# EasyEDA Pro project RK3568_DEV.epro, schematic Schematic1, sheets 1 to 12 of 27

## Sheets
1 SOC_CAM: Board Name: Board1; Create Date: 2025-08-15; Page Name: SOC_CAM; Project Name: RK3568_LPD4X_120P_Core; Schematic Name: Schematic1; Update Date: 2025-08-22; BladeWidth: 10; Company: 嘉立创EDA; Page Size: A4; RegionStart: 1; ShowBorder: 1; TitleBlock: 1; TitleBlockPosition: 3; Version: V1.0; XRegionCount: 6; YRegionCount: 4
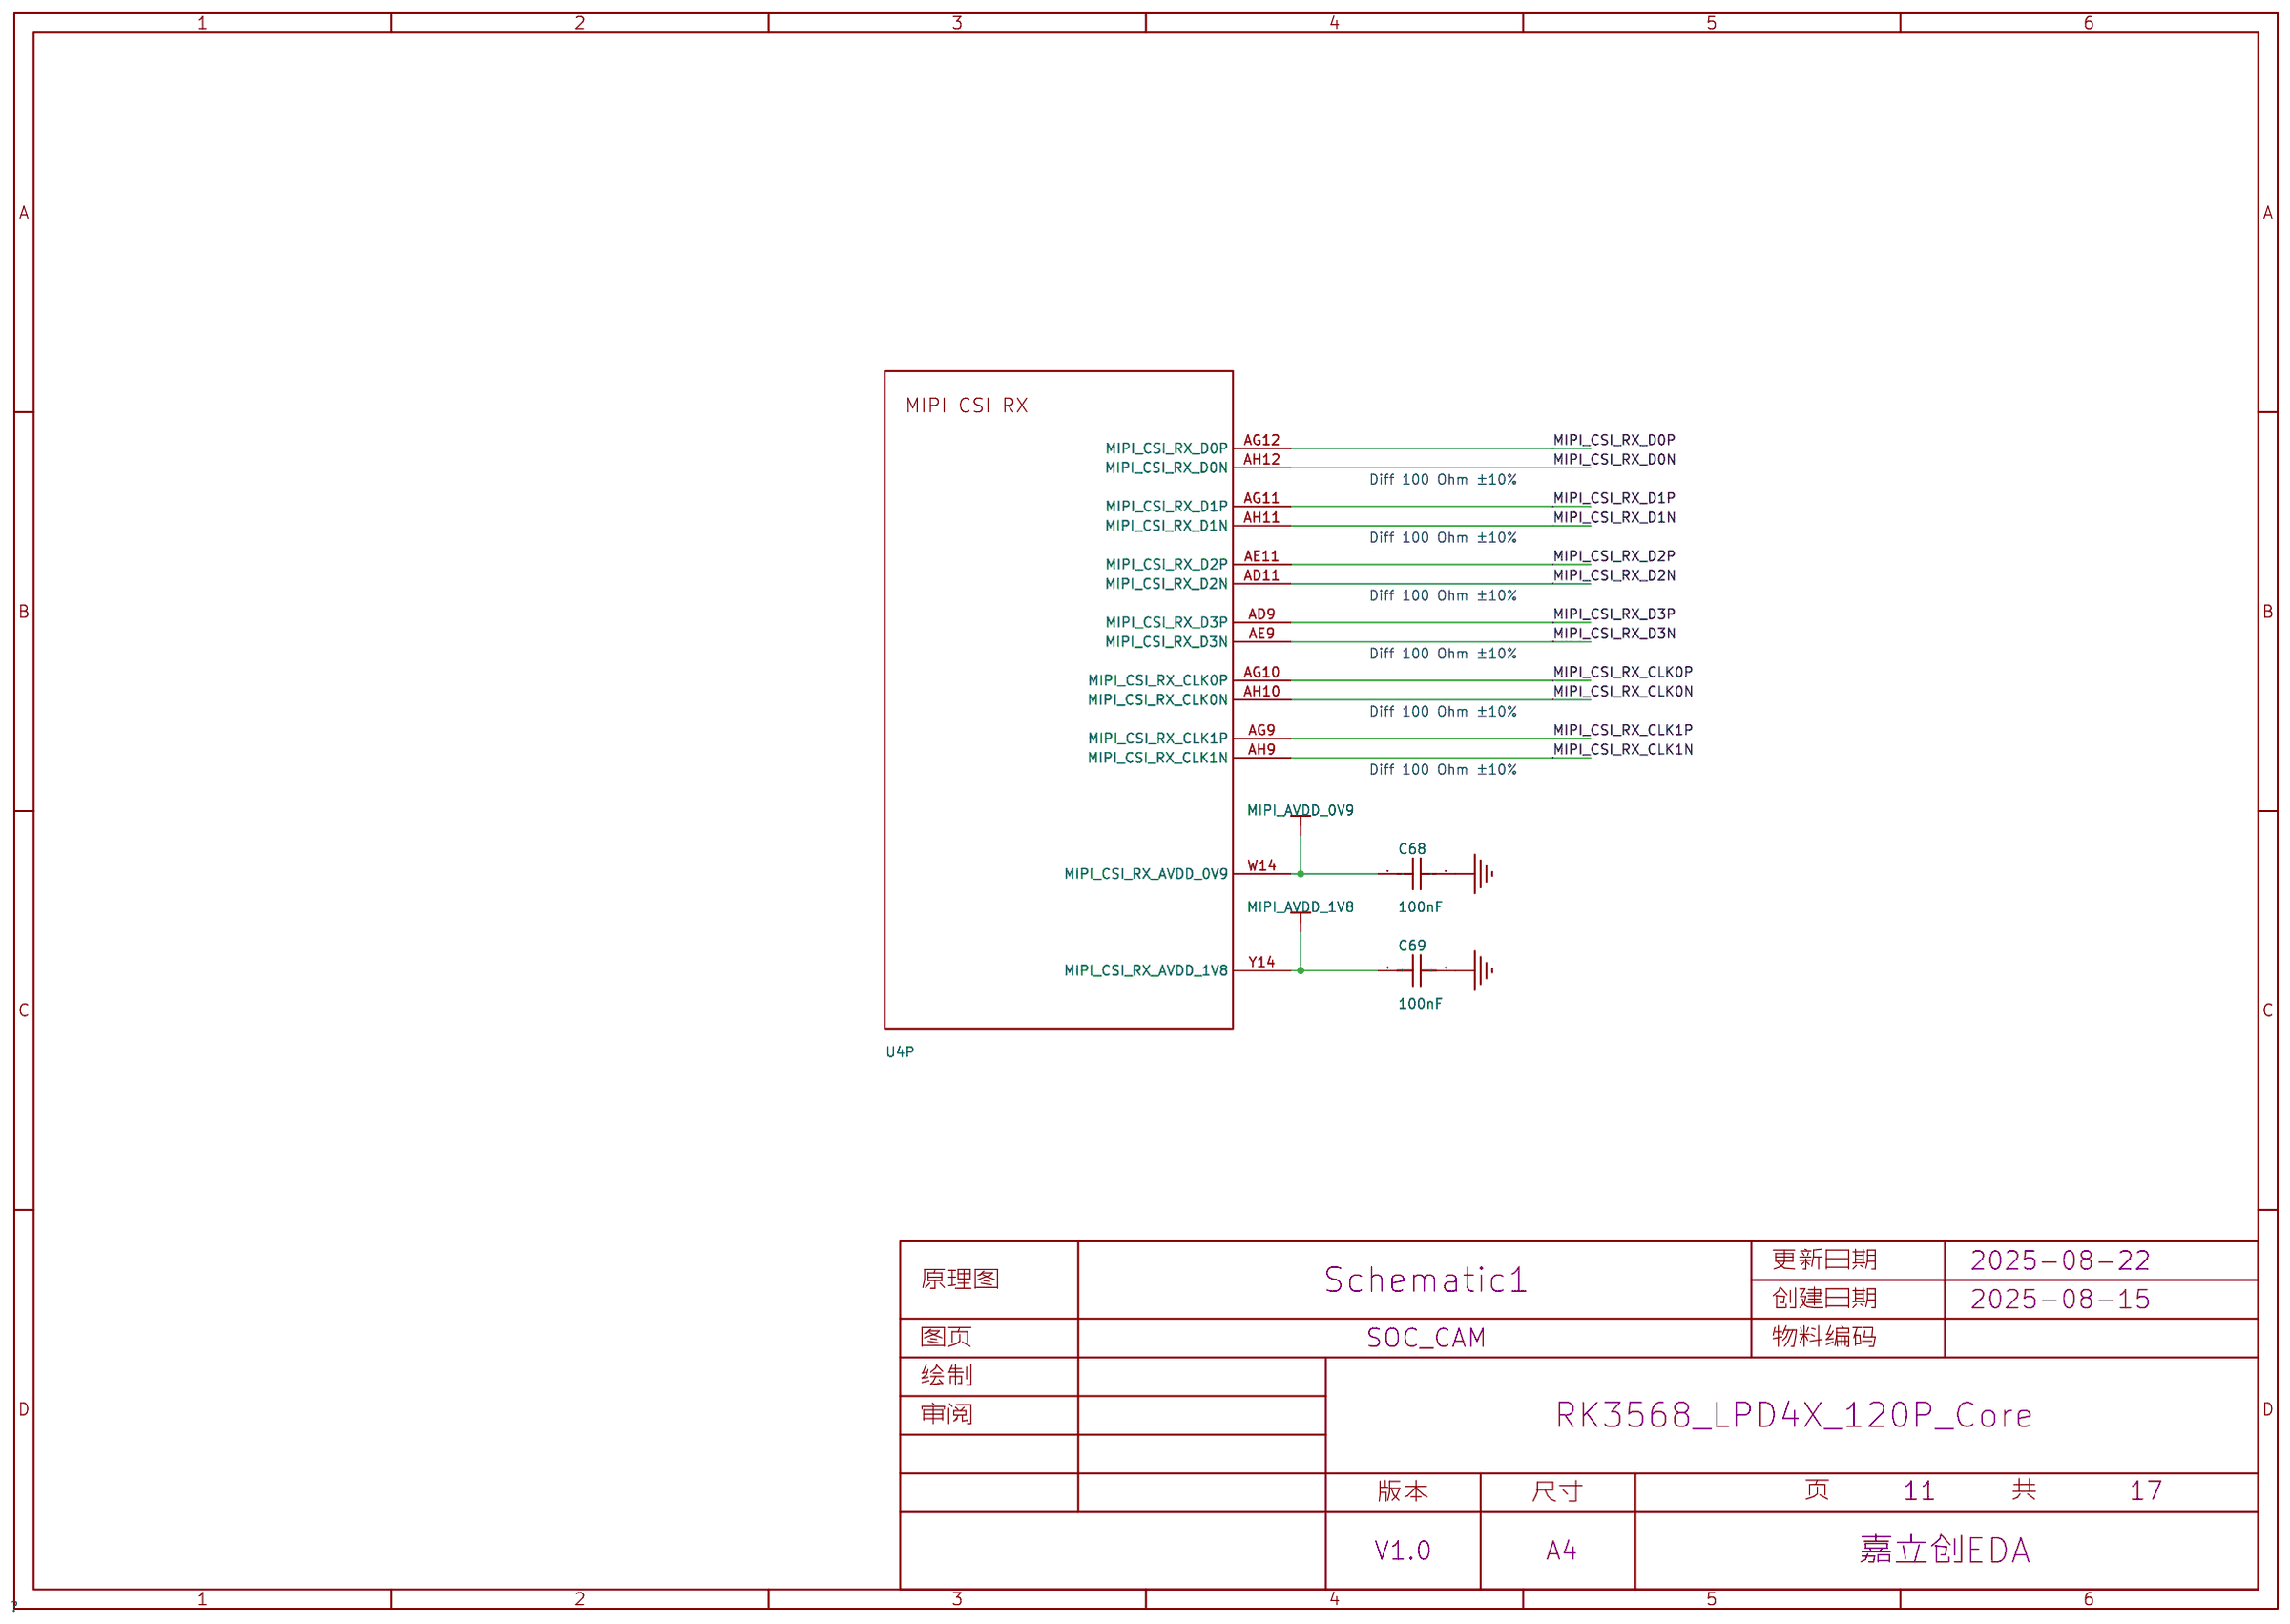
[diagram p0: SOC_CAM]
2 项目概述: Create Date: 2025-09-28; Page Name: 项目概述; Project Name: Rk3568B路由器; Update Date: 2025-09-28
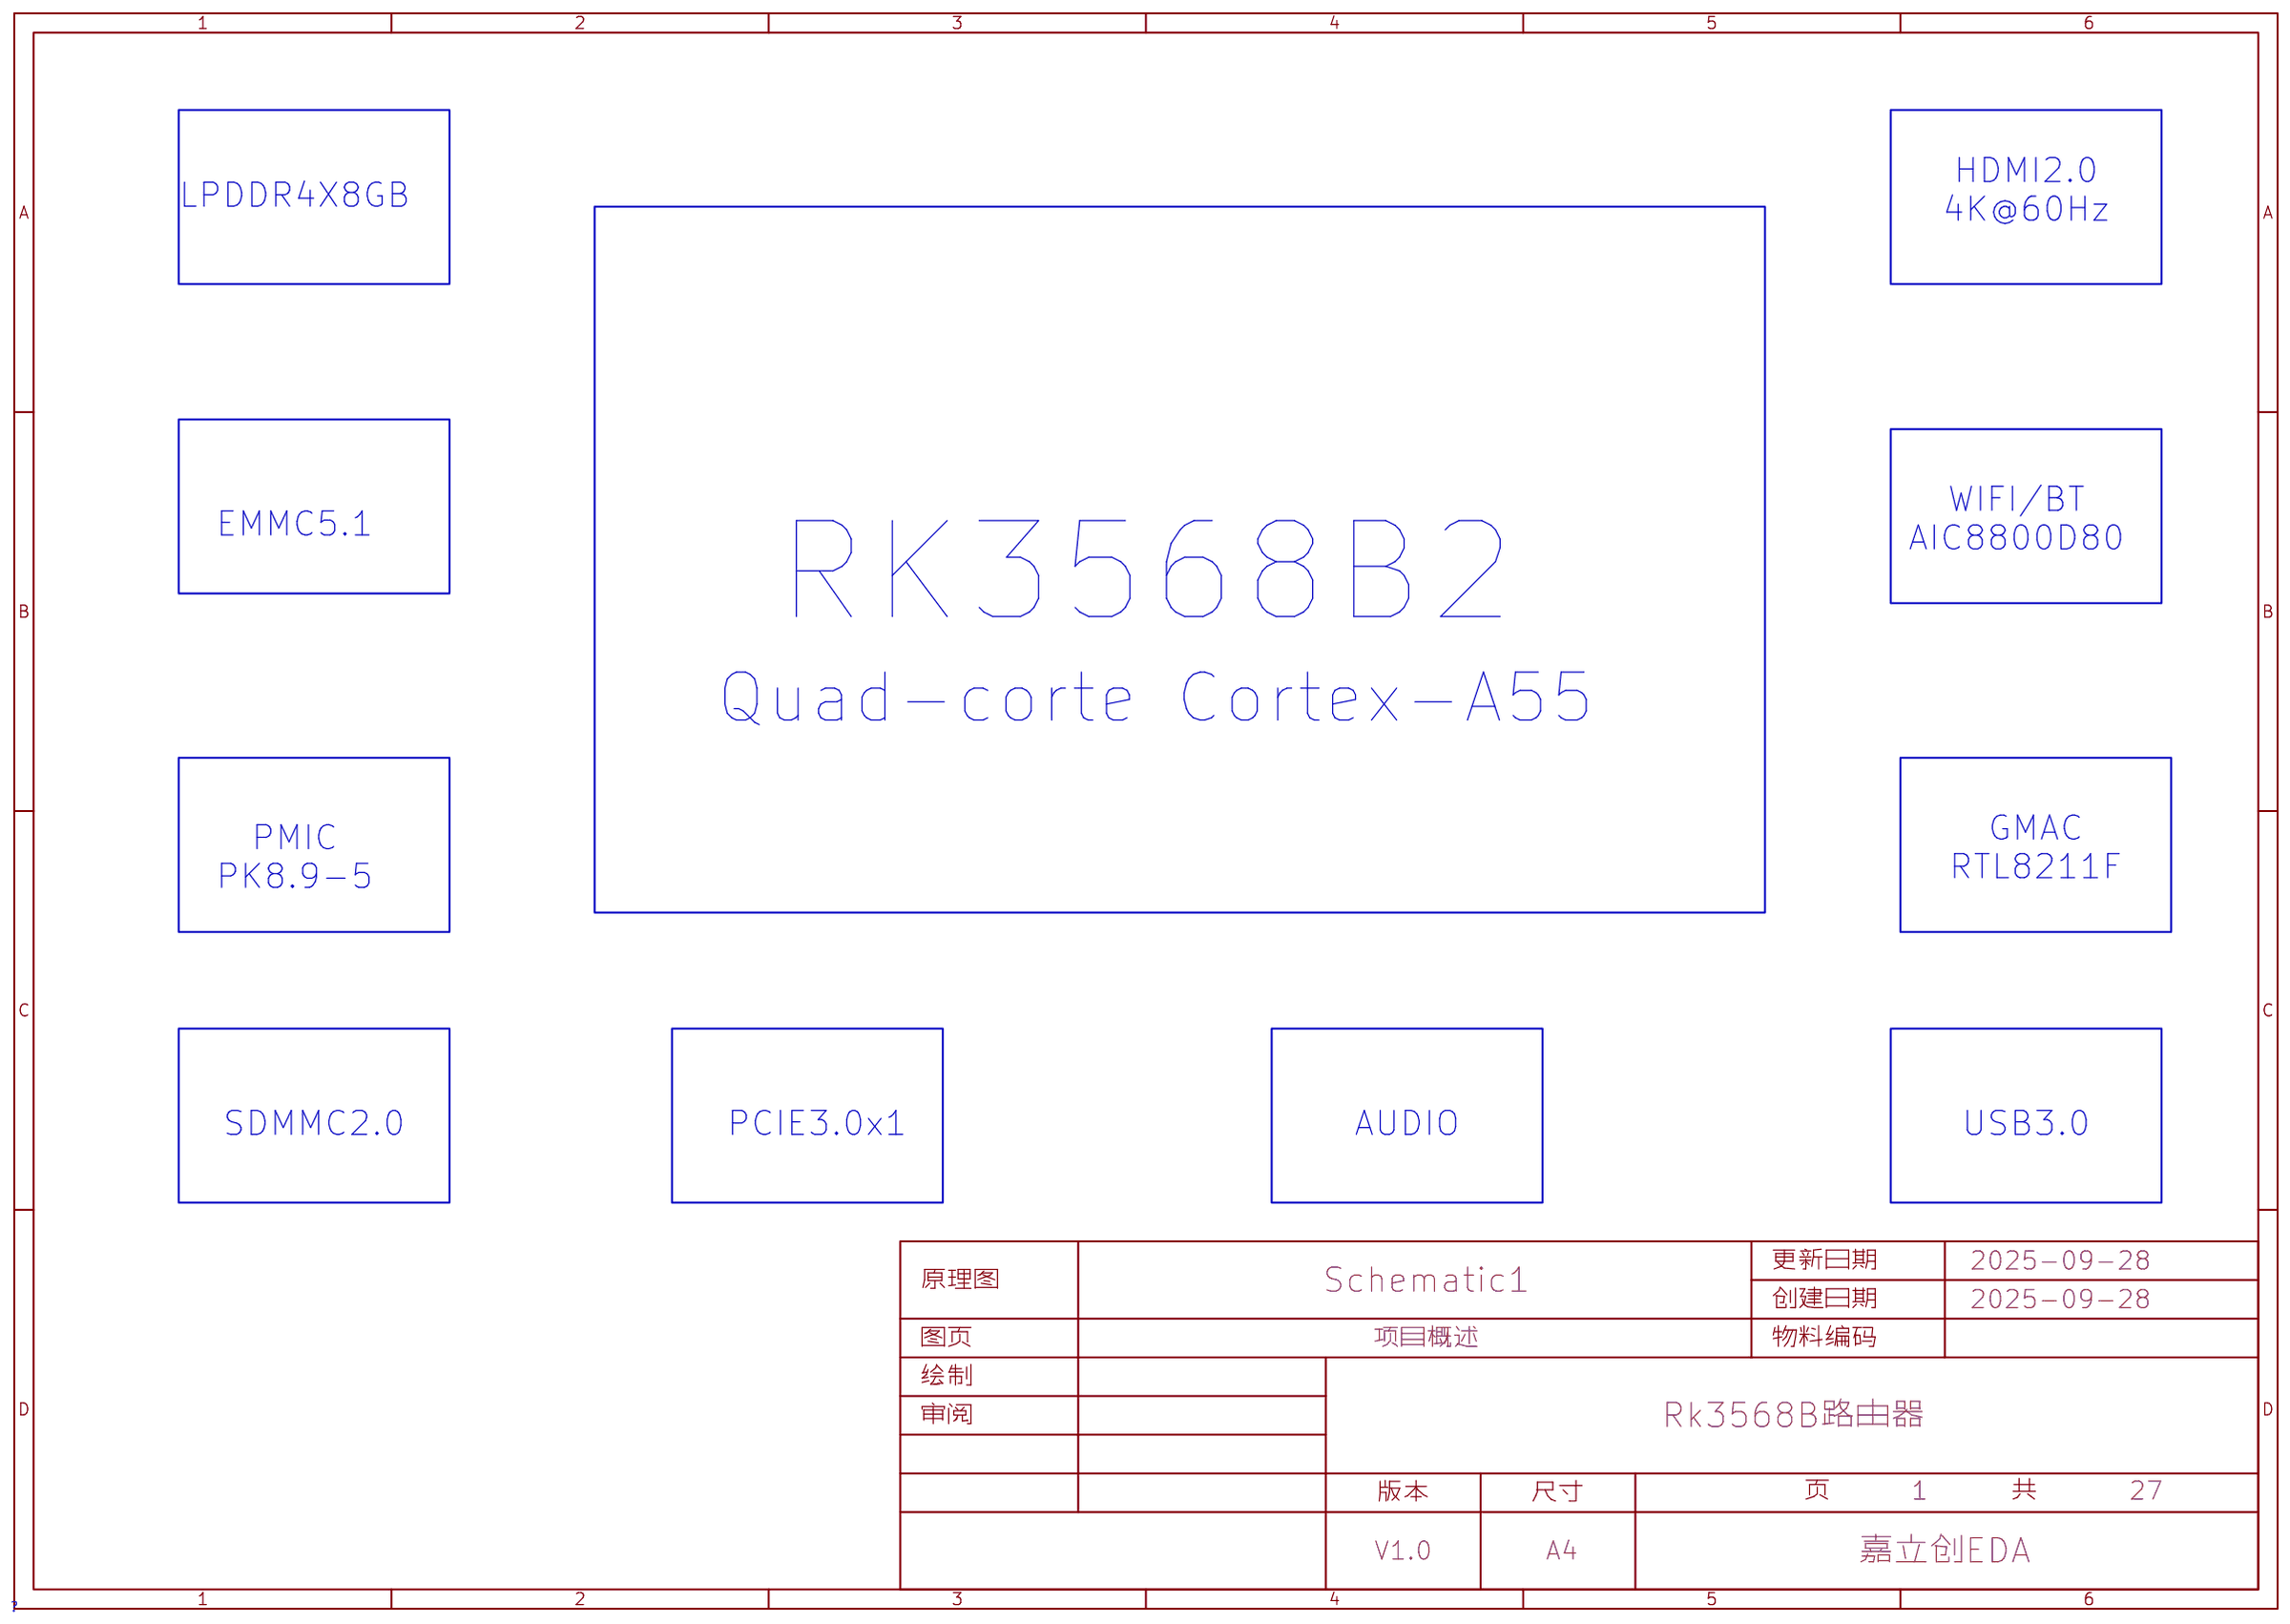
[diagram p1: 项目概述]
3 外设资源分配&上电时序: Page Name: 外设资源分配&上电时序; Project Name: ProDoc_Board1_2026-04-14; Update Date: 2026-04-03
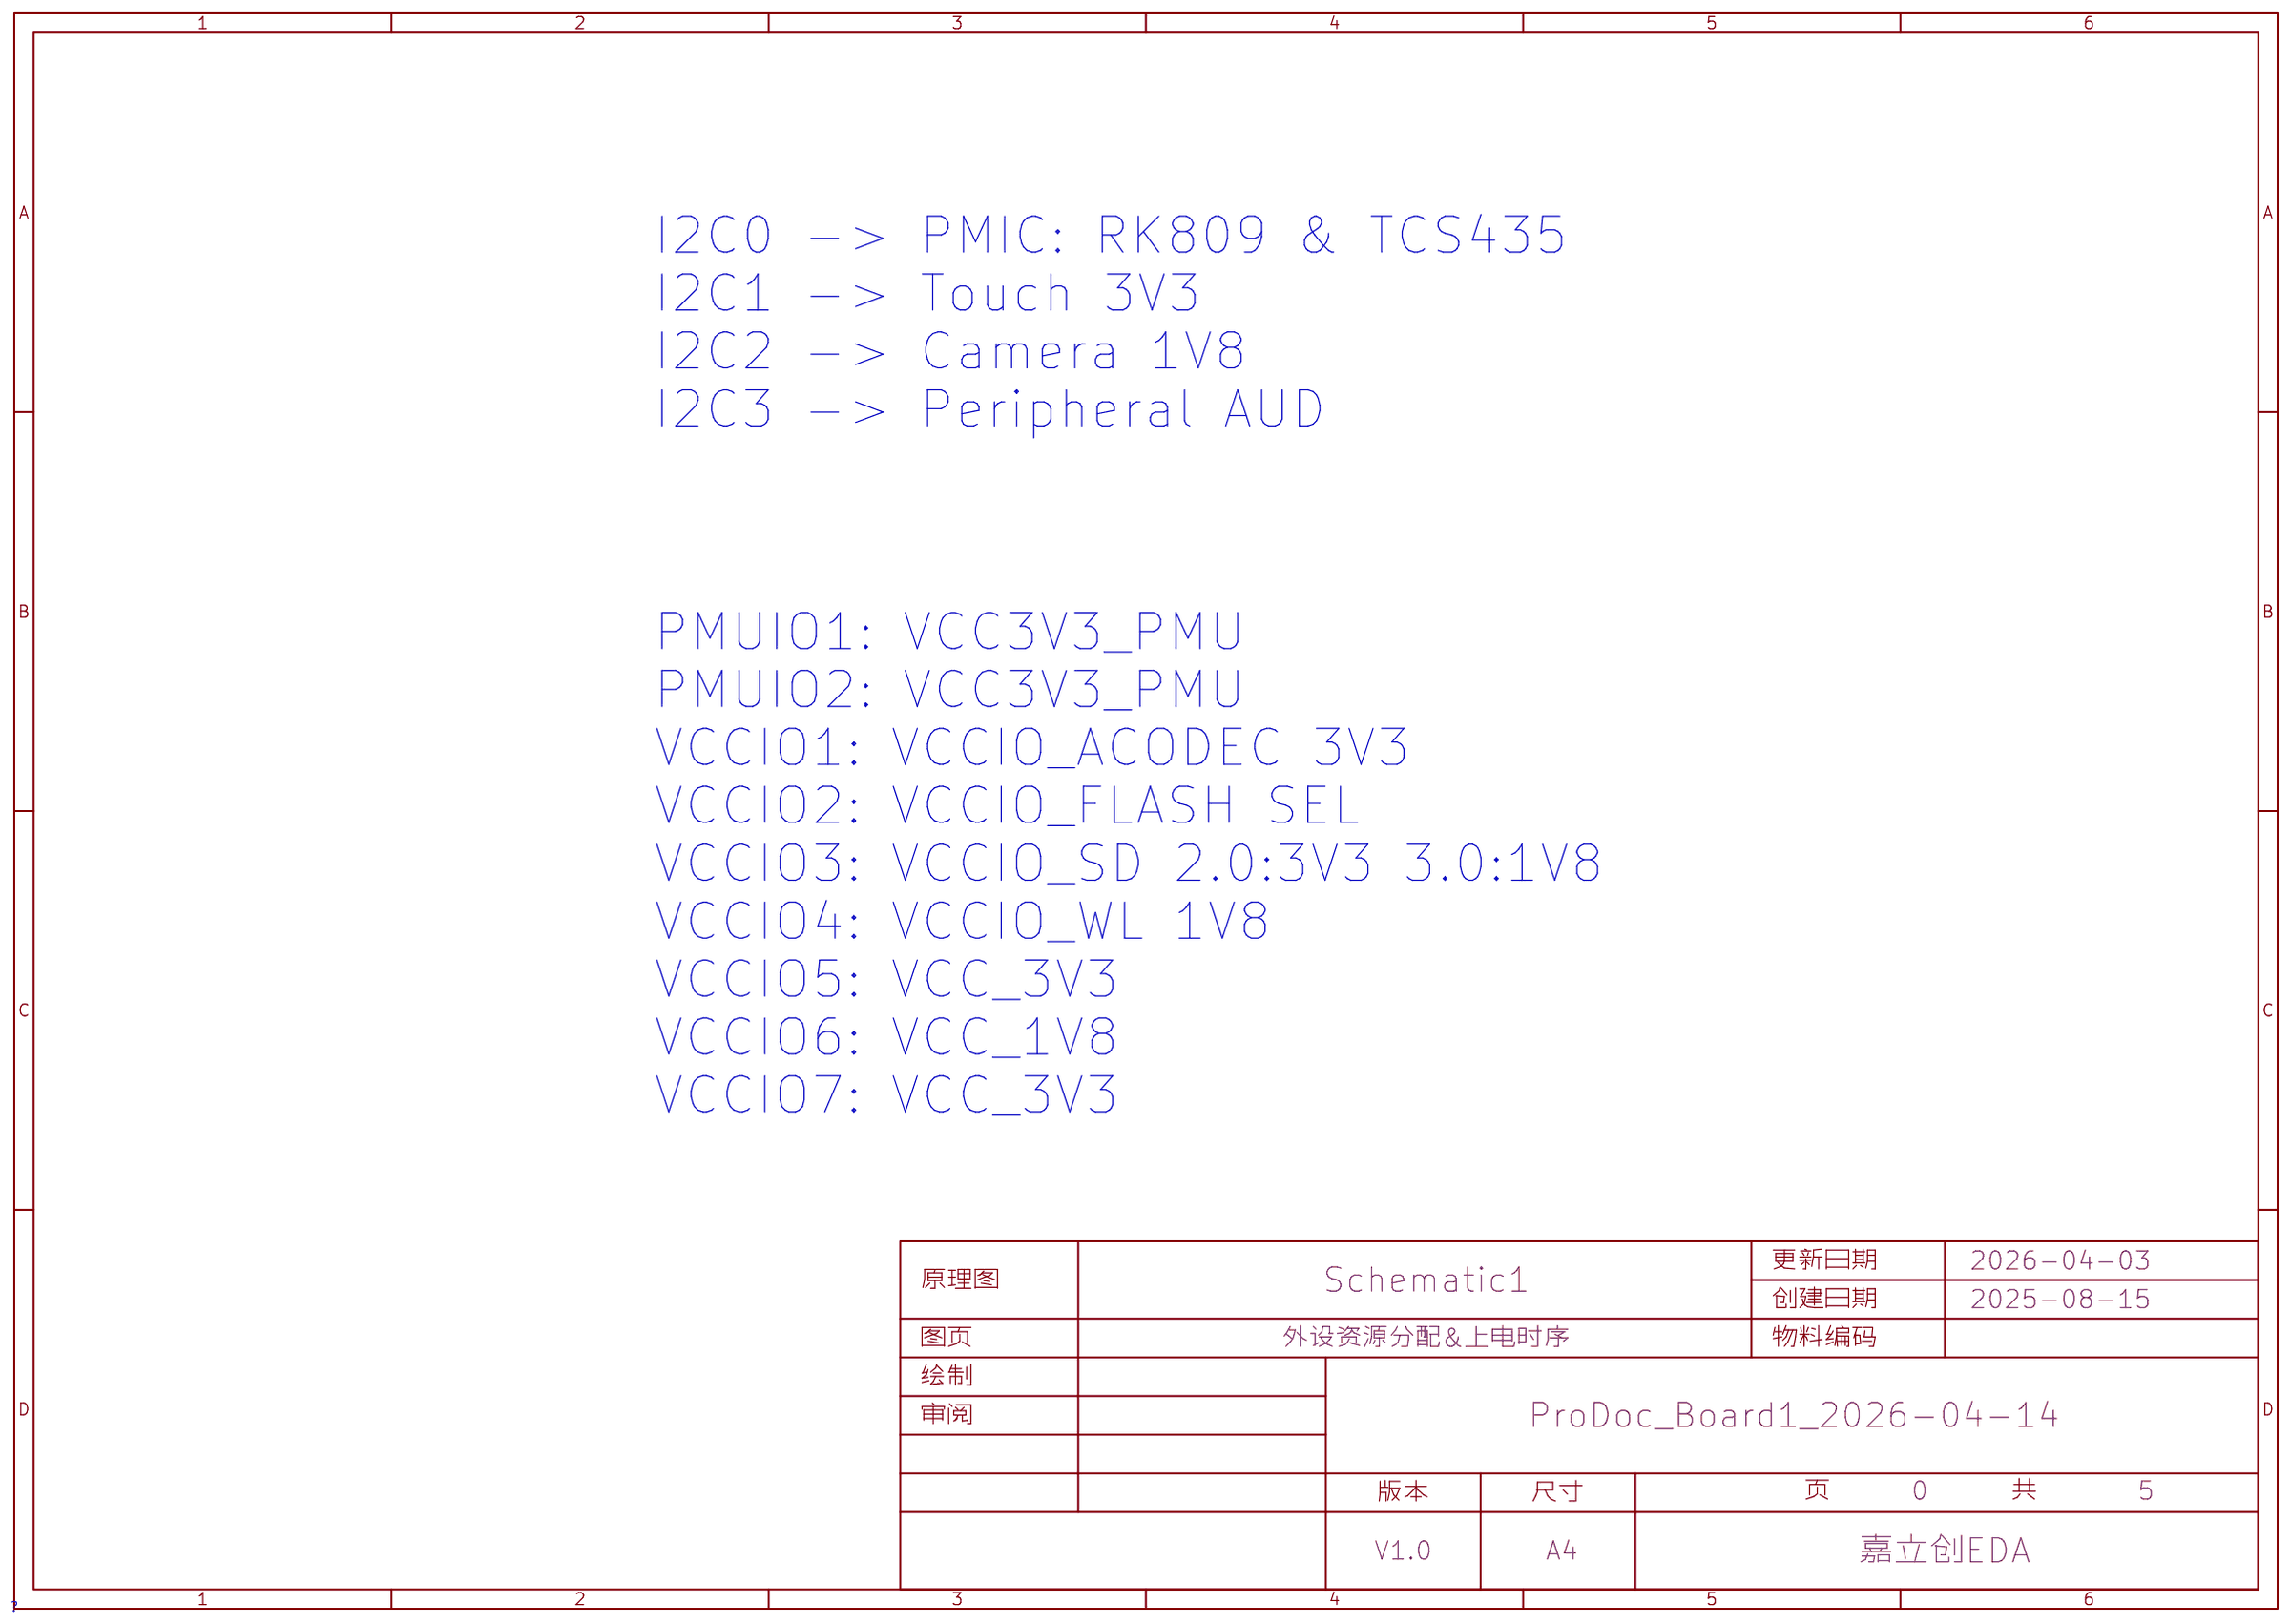
[diagram p2: 外设资源分配&上电时序]
4 KEY/LED: Create Date: 2025-09-11; Page Name: KEY/LED; Project Name: RK3568B2地瓜派; Update Date: 2025-09-11
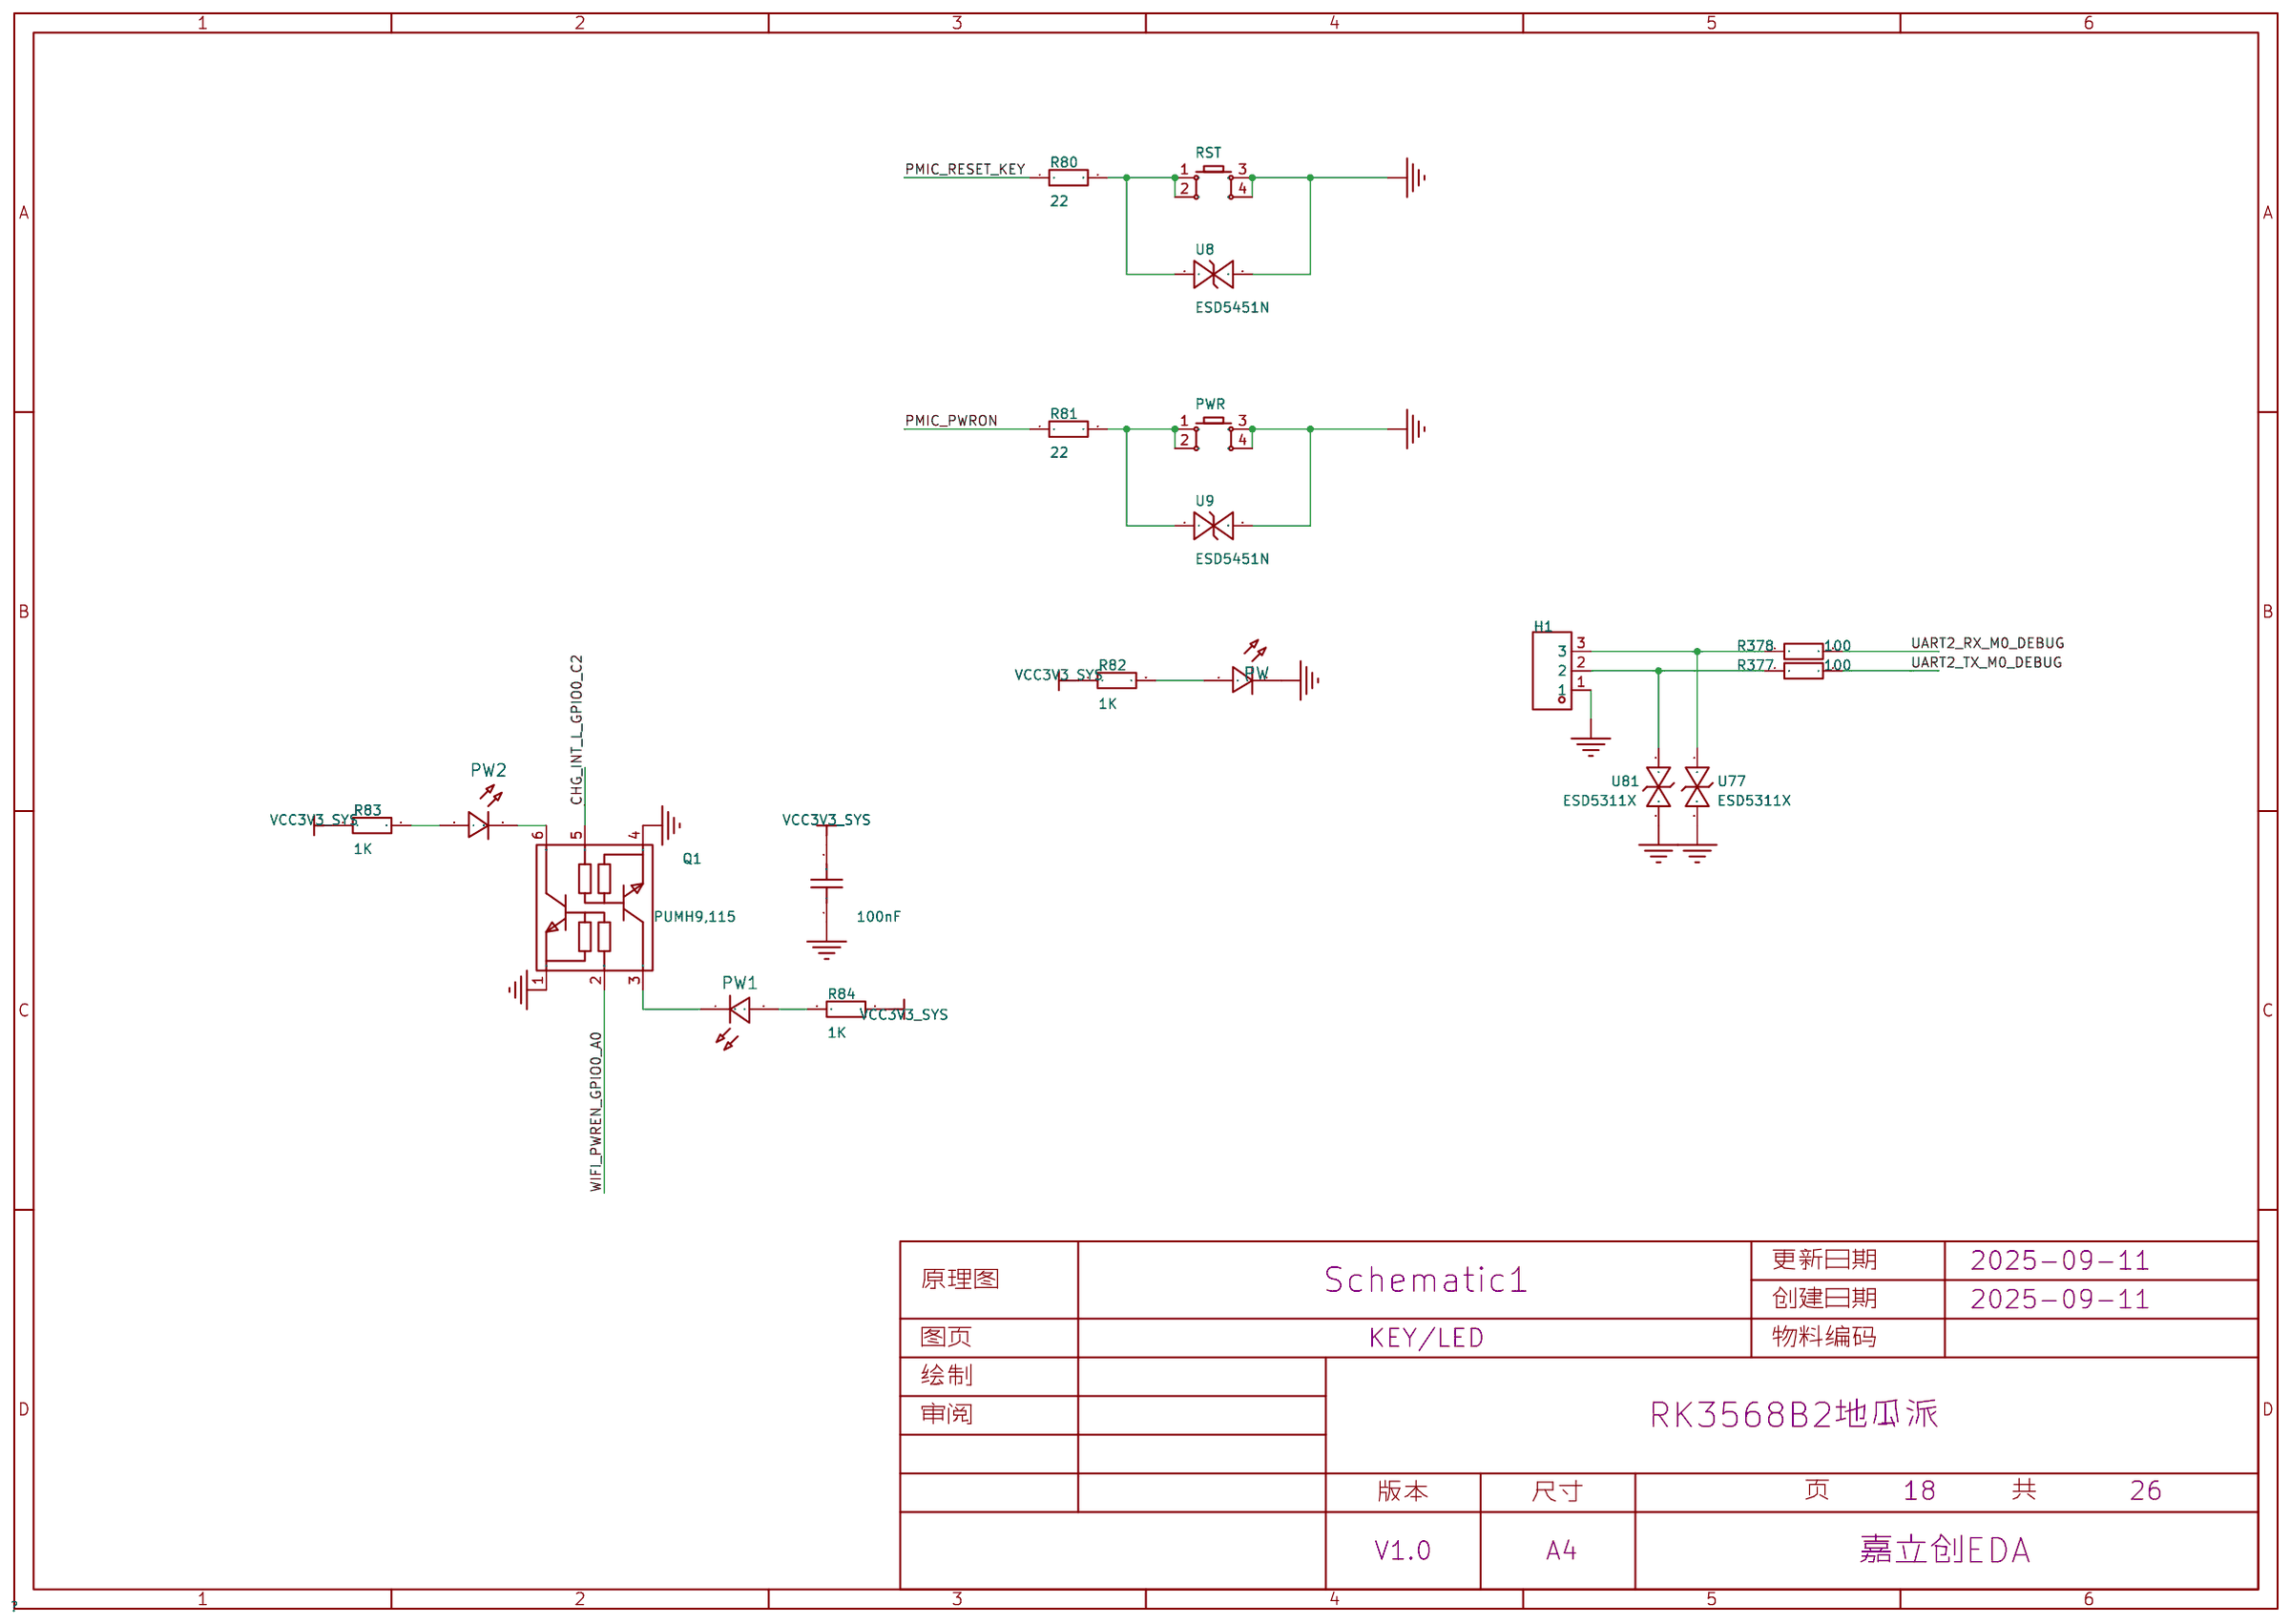
[diagram p3: KEY/LED]
5 SOC_LOGIC: Page Name: SOC_LOGIC; Update Date: 2025-08-26
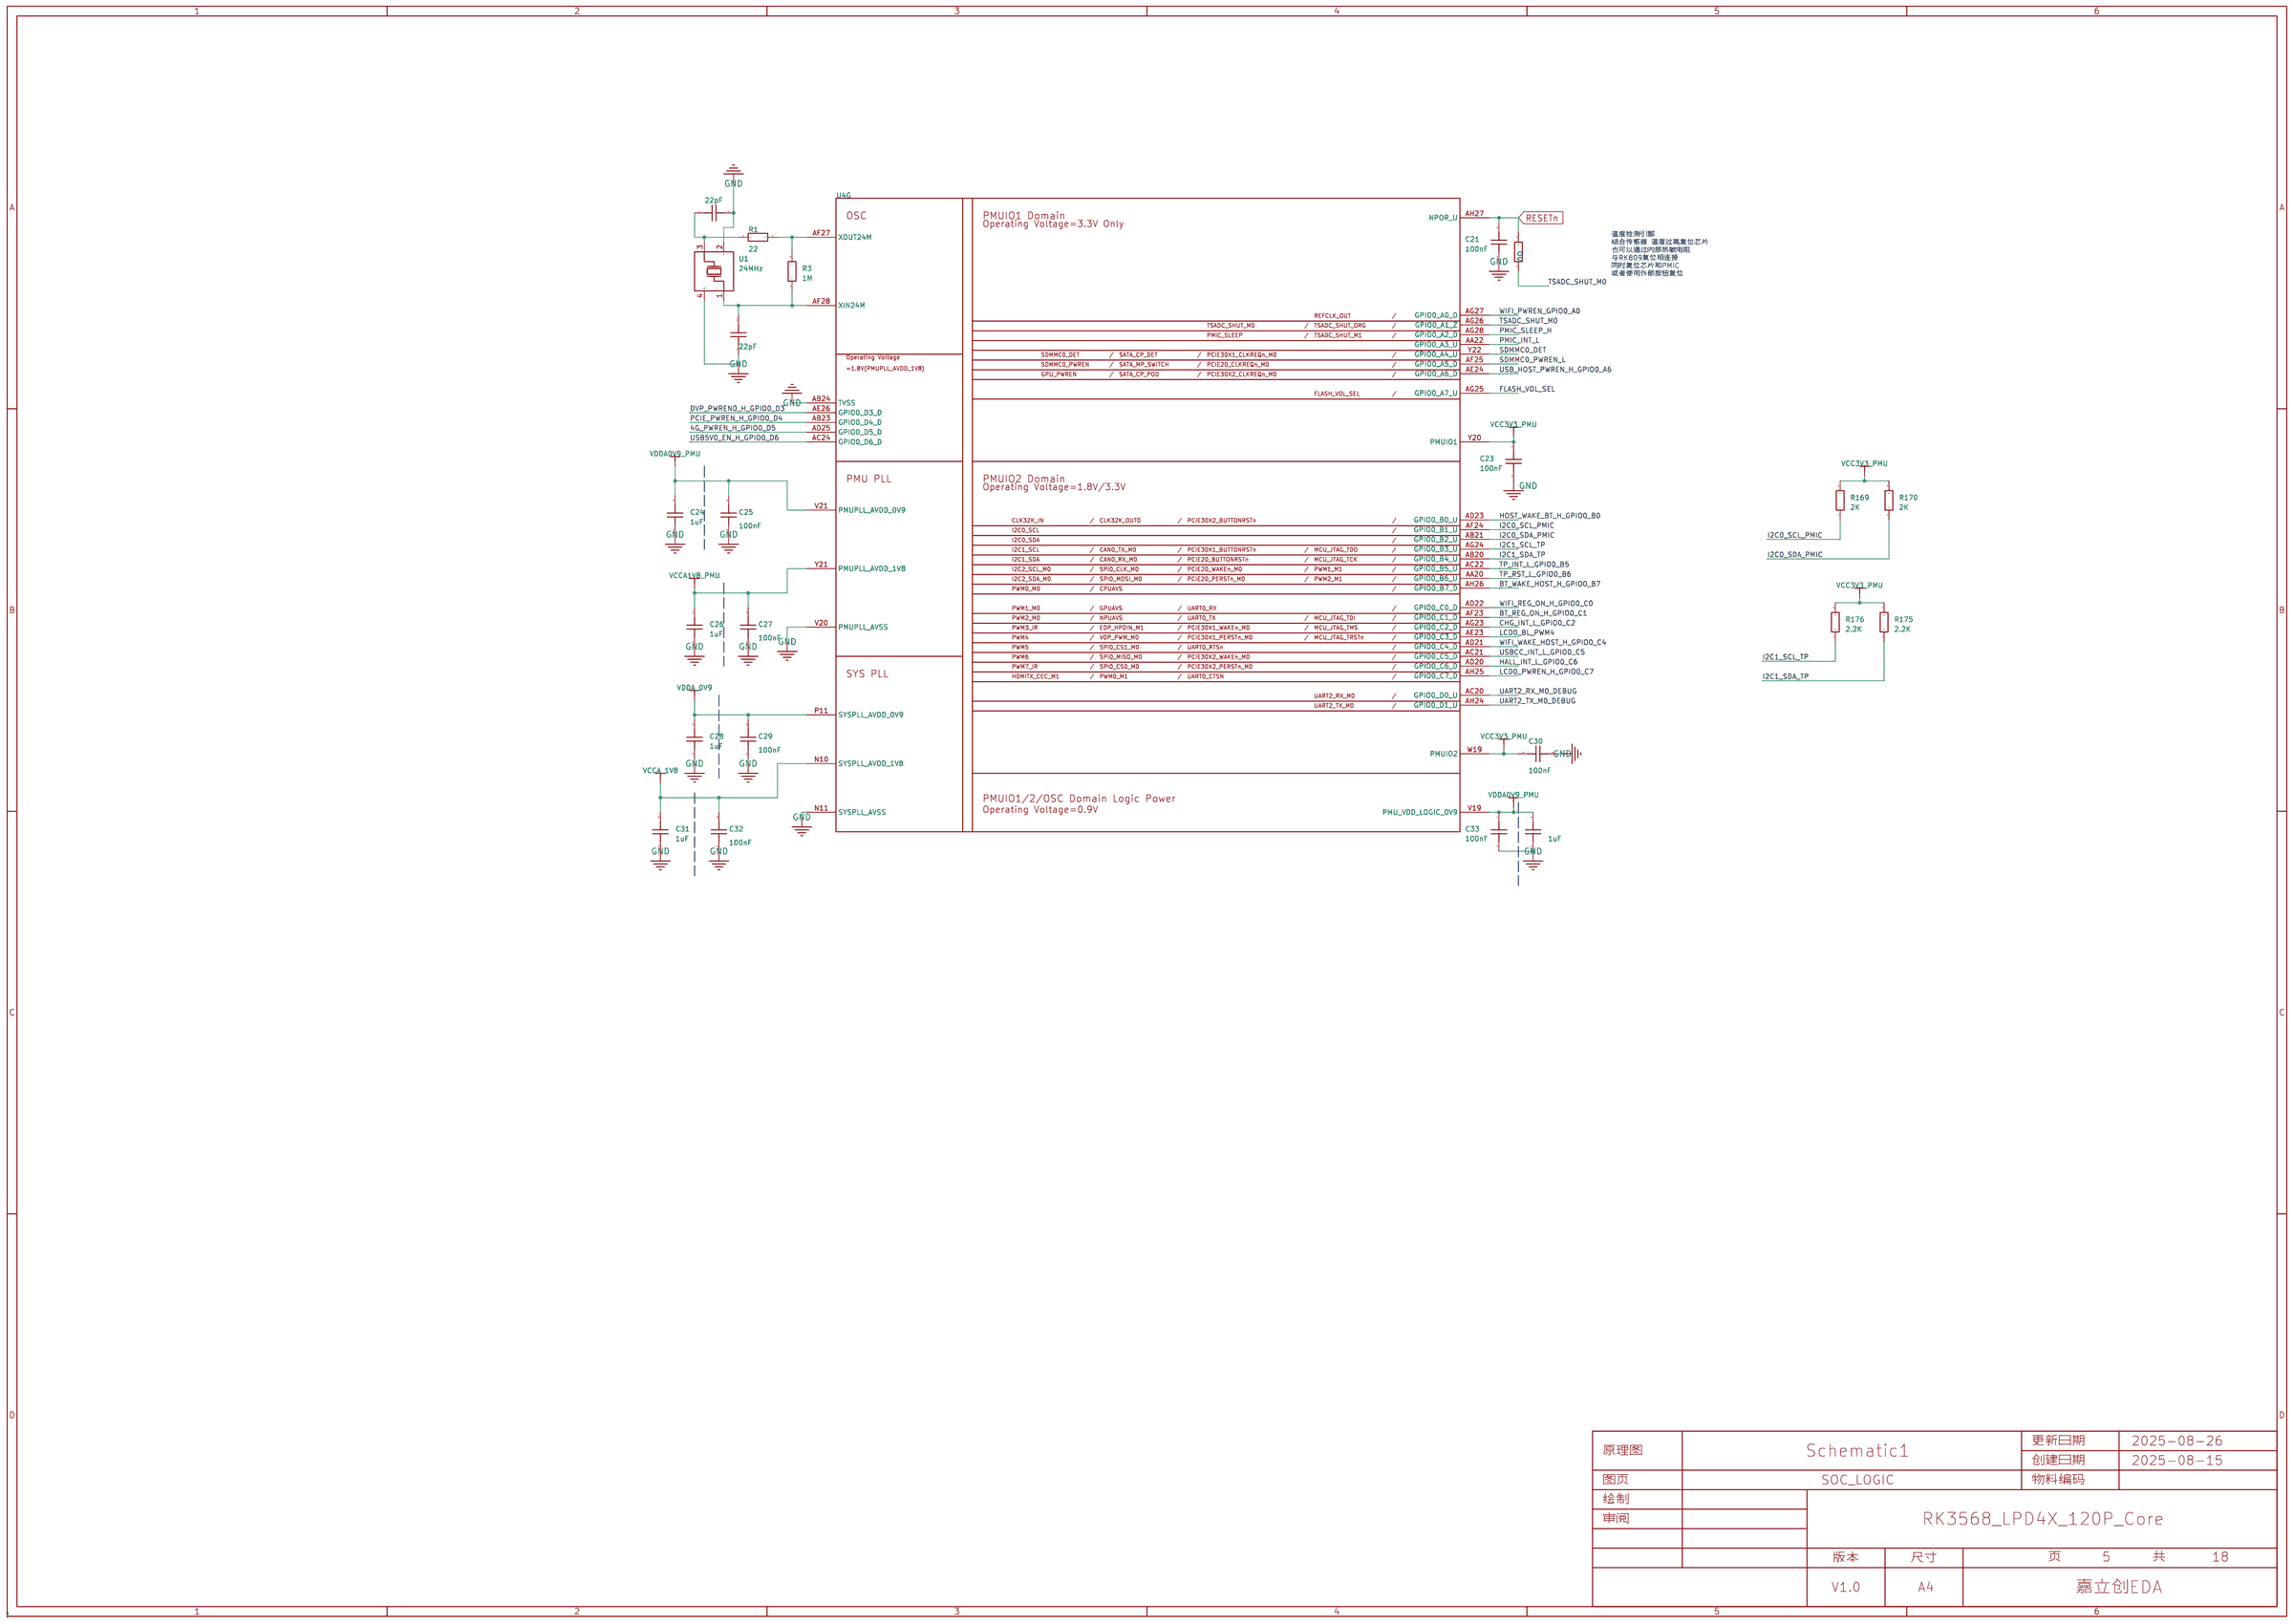
[diagram p4: SOC_LOGIC]
6 LPDDR4/4X: Page Name: LPDDR4/4X; Update Date: 2025-08-20
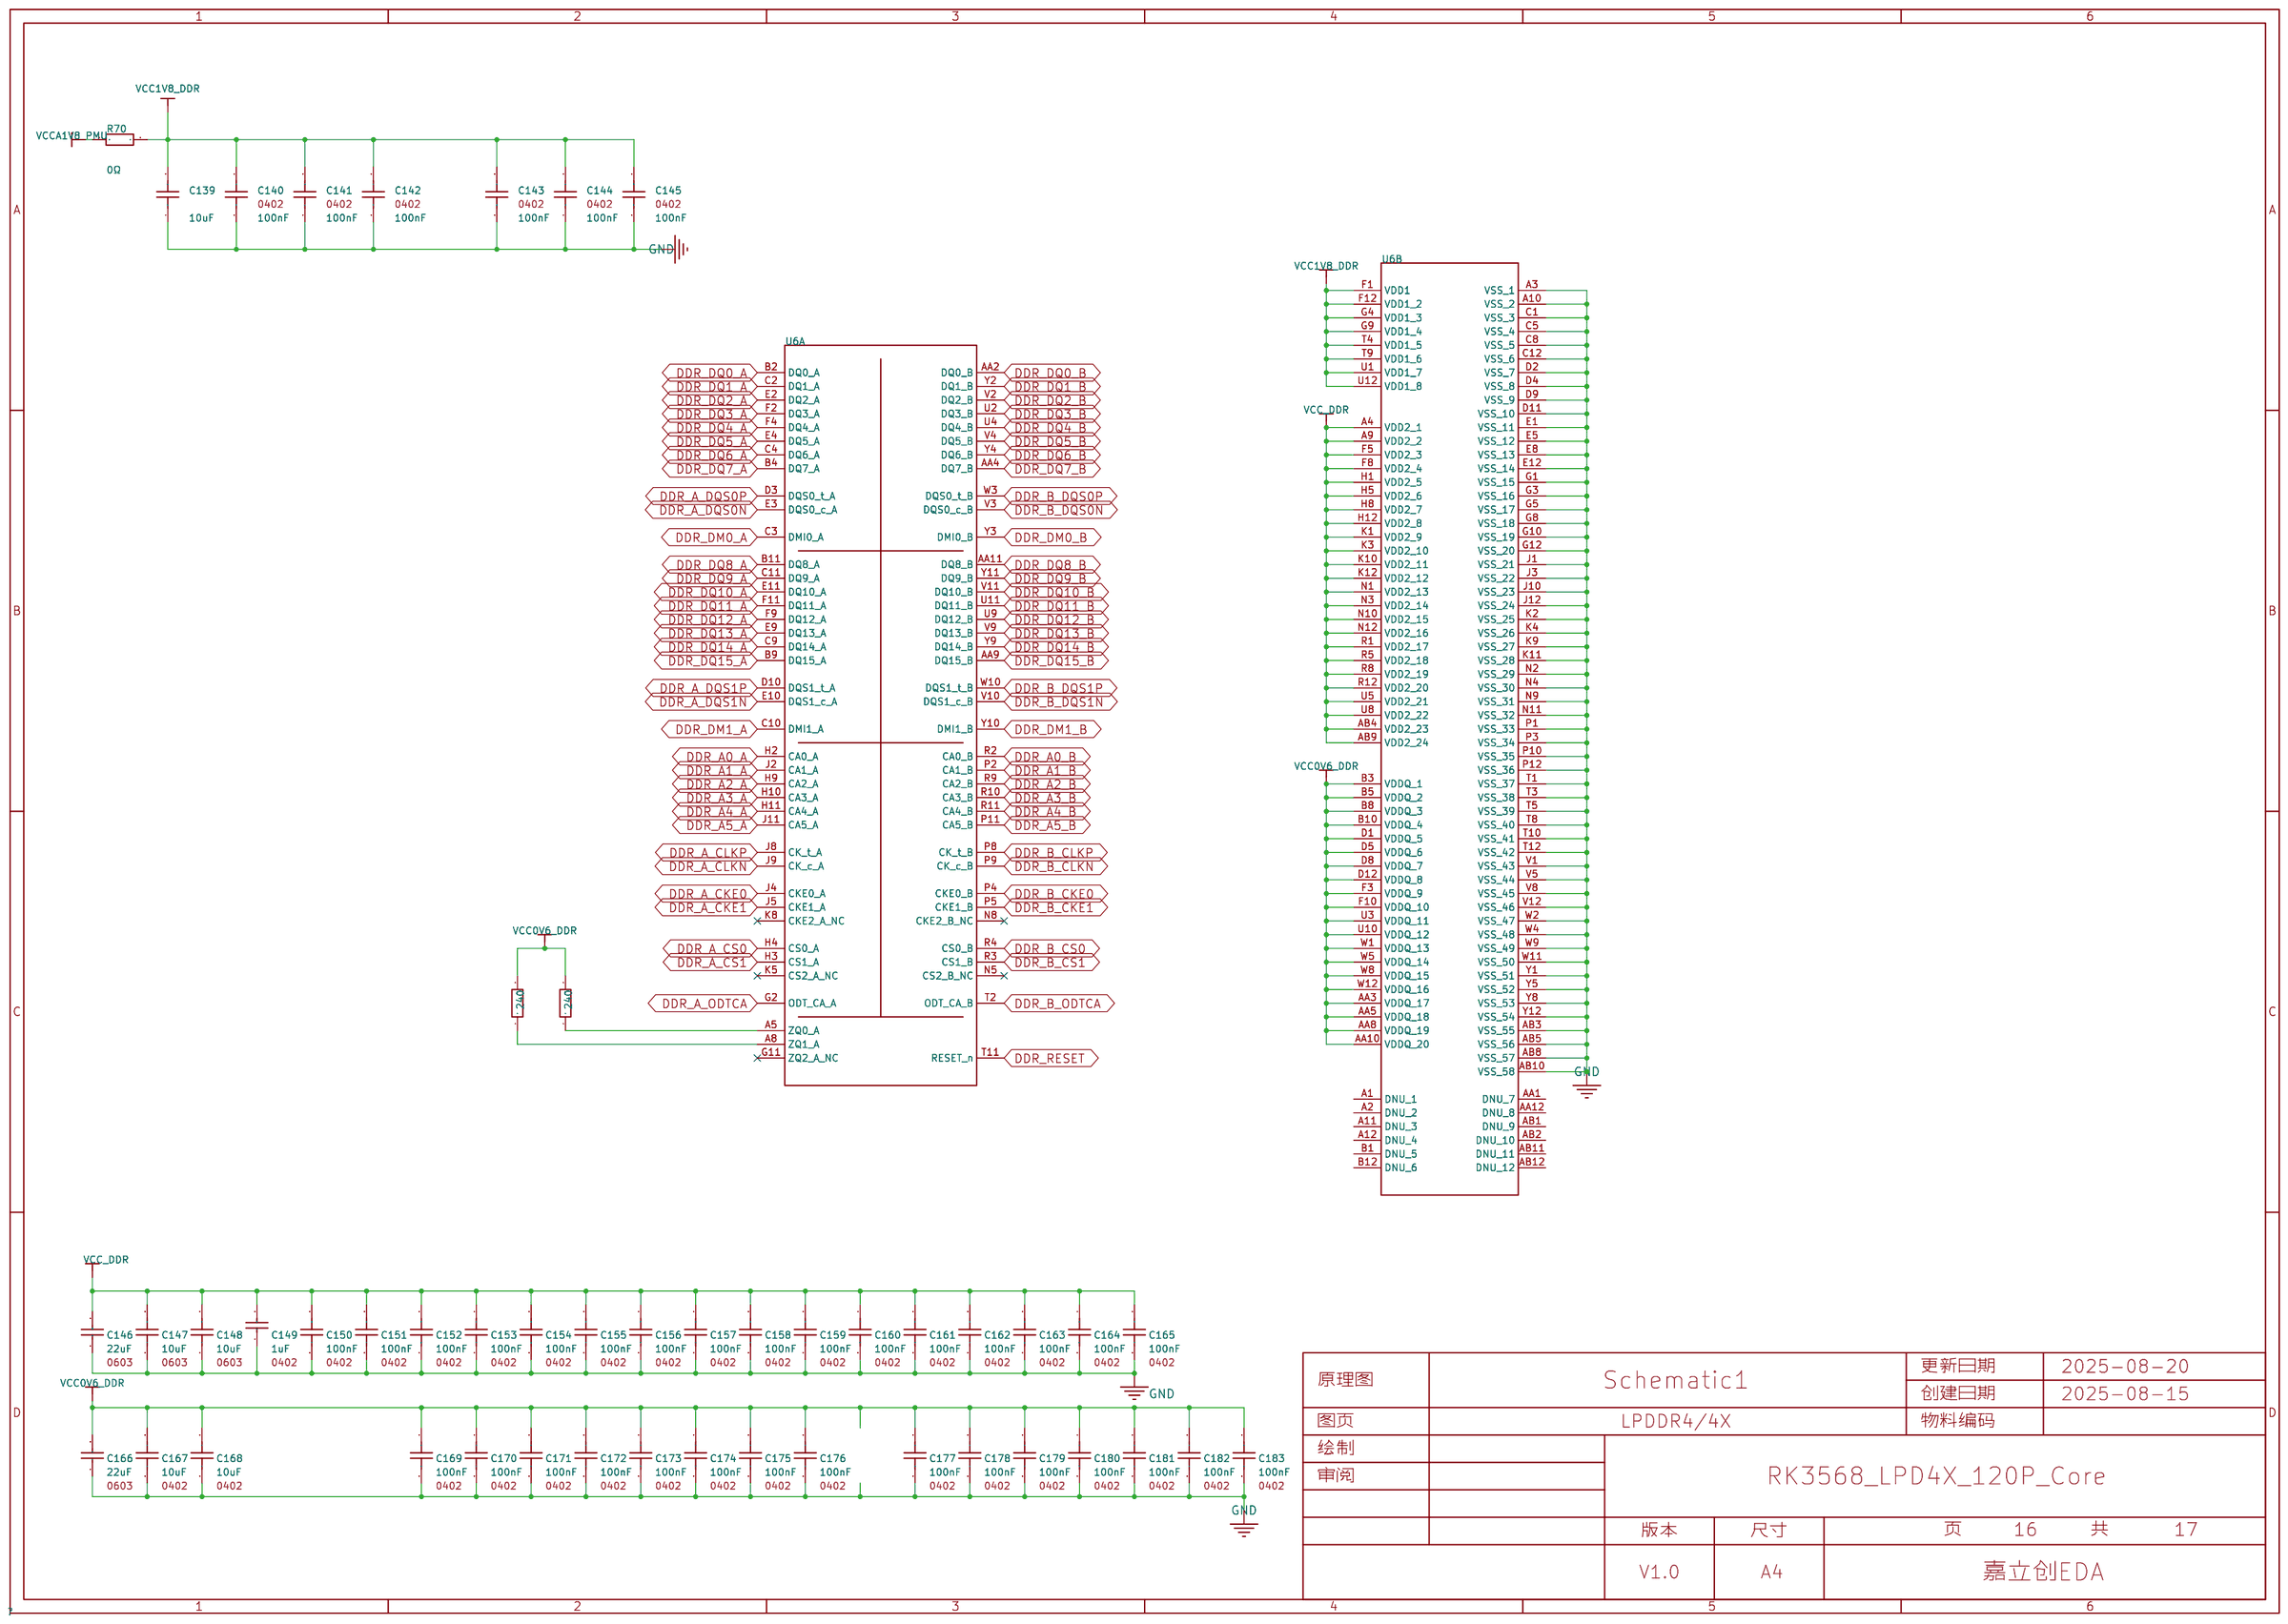
[diagram p5: LPDDR4/4X]
7 SOC_FLASH: Page Name: SOC_FLASH; Update Date: 2025-08-24
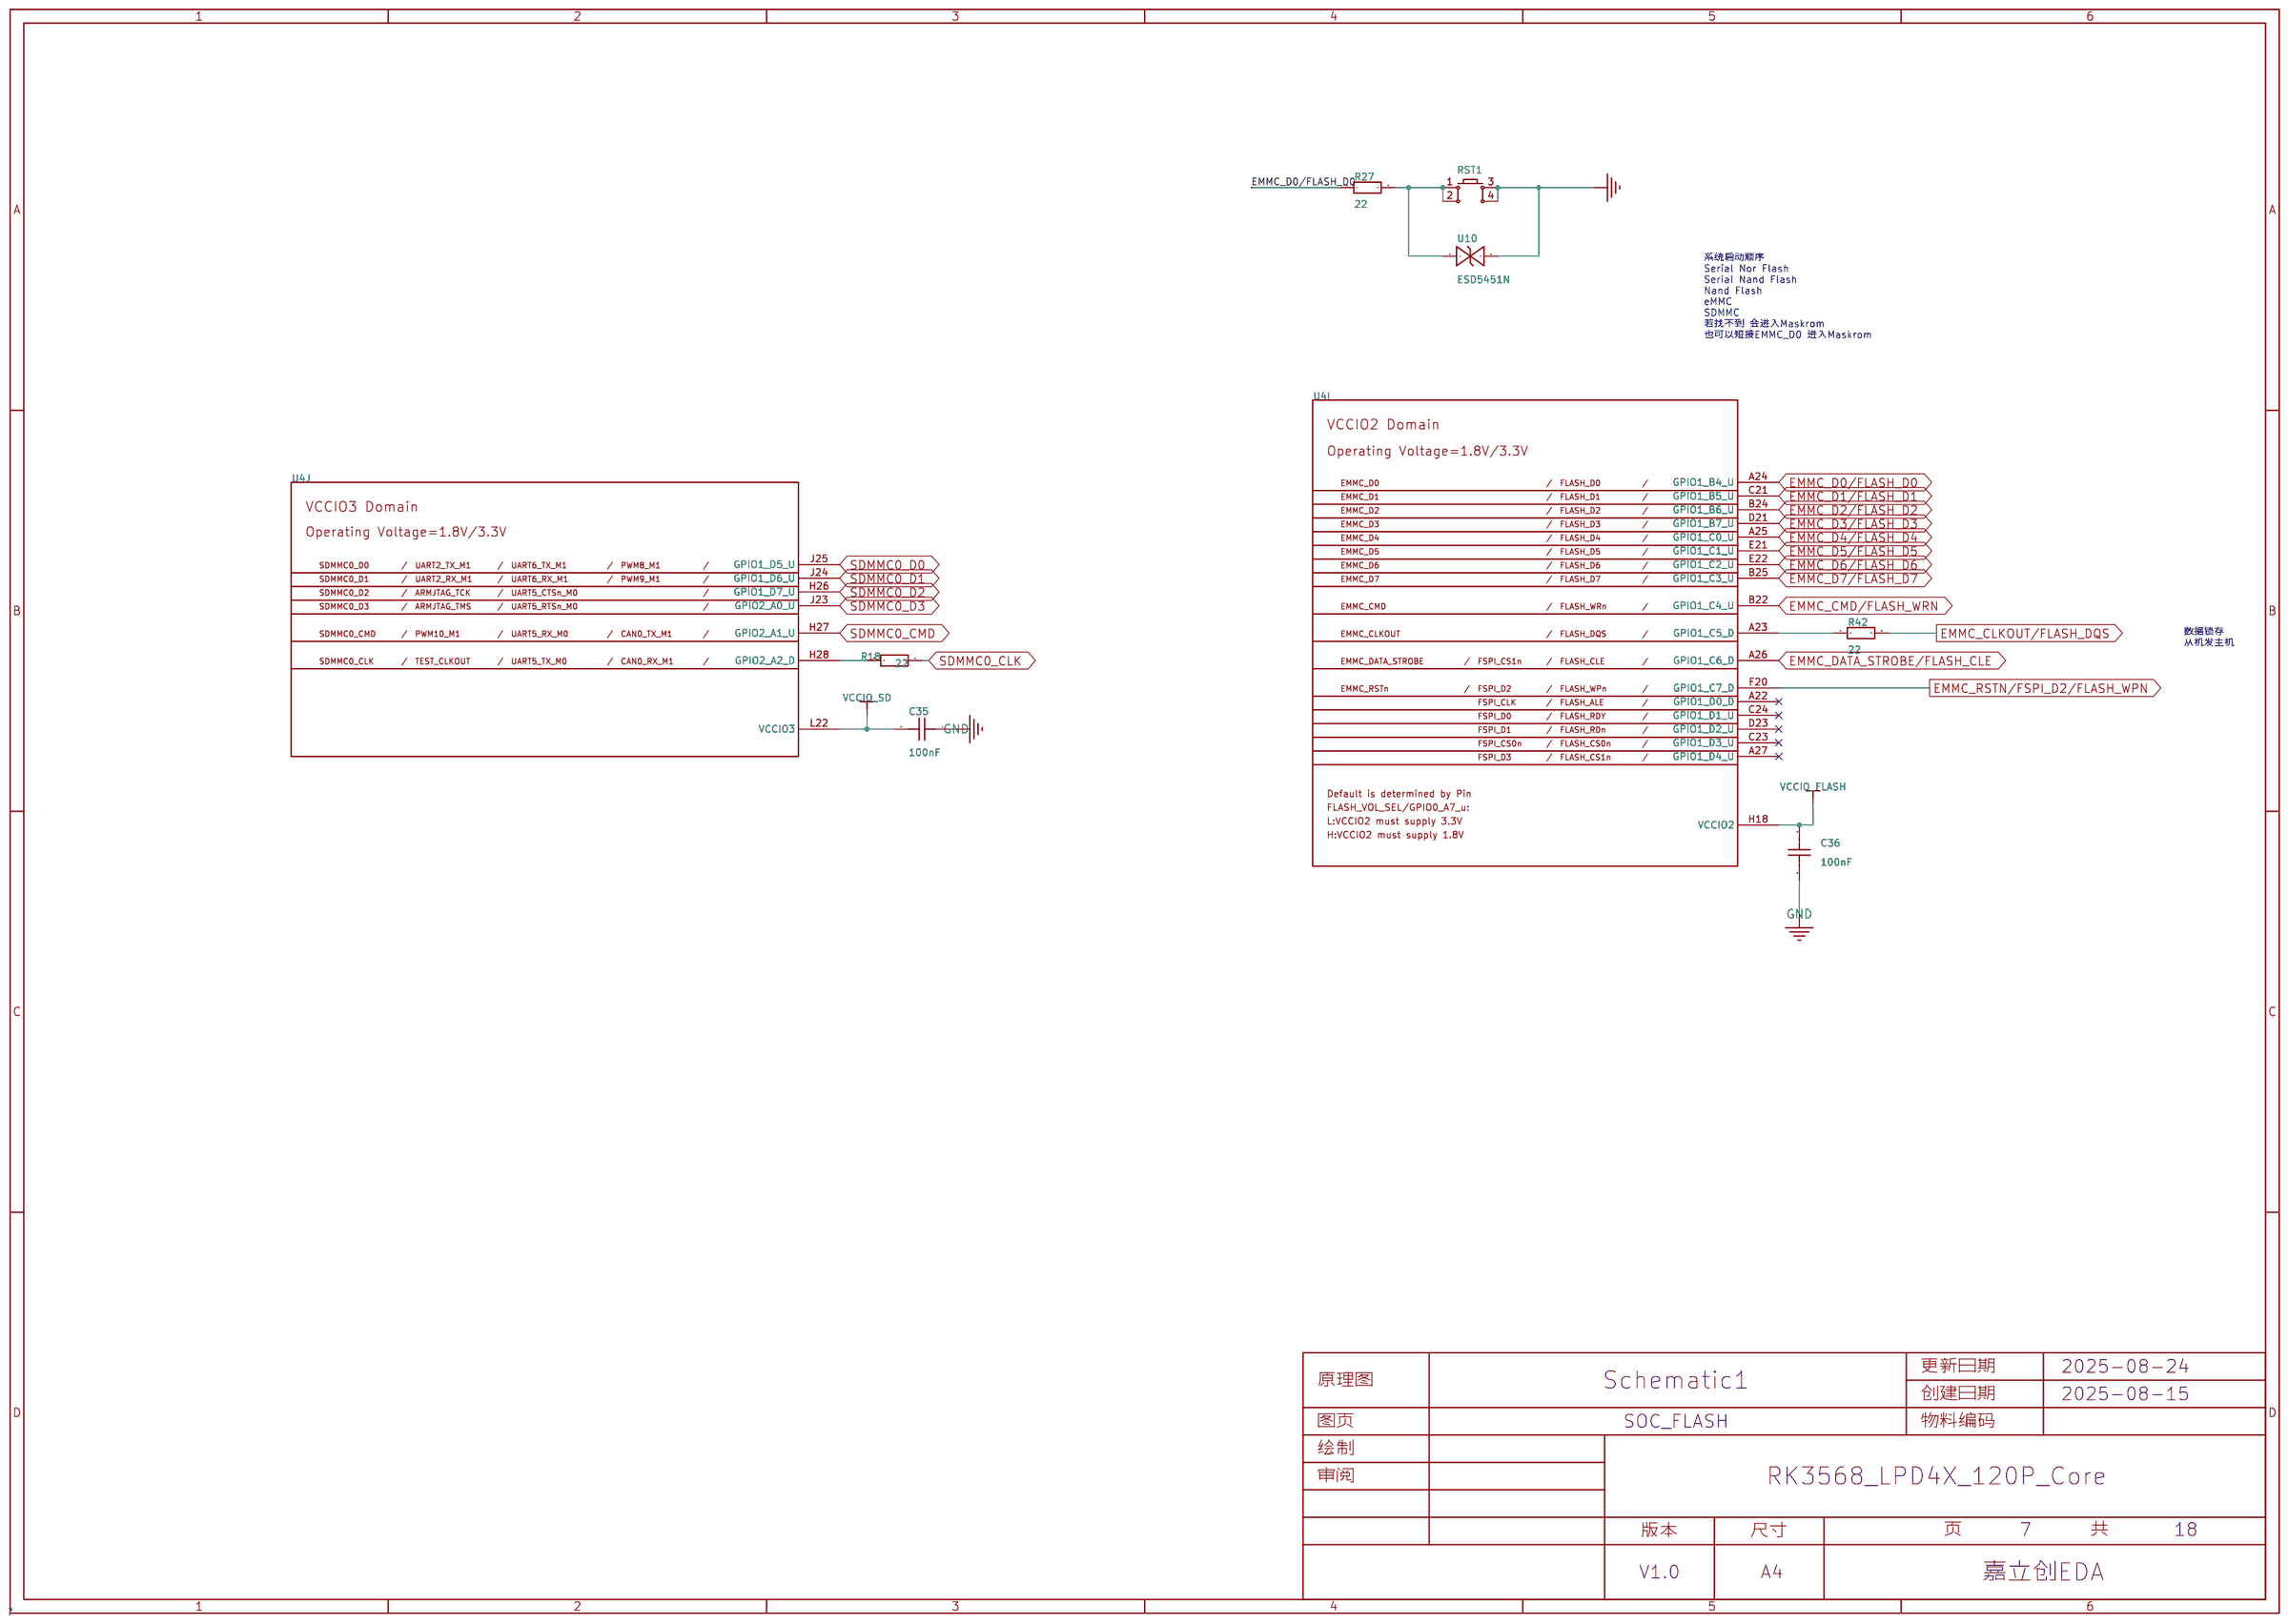
[diagram p6: SOC_FLASH]
8 PCIE: Create Date: 2025-09-12; Page Name: PCIE; Project Name: RK3568B2地瓜派; Update Date: 2025-09-15
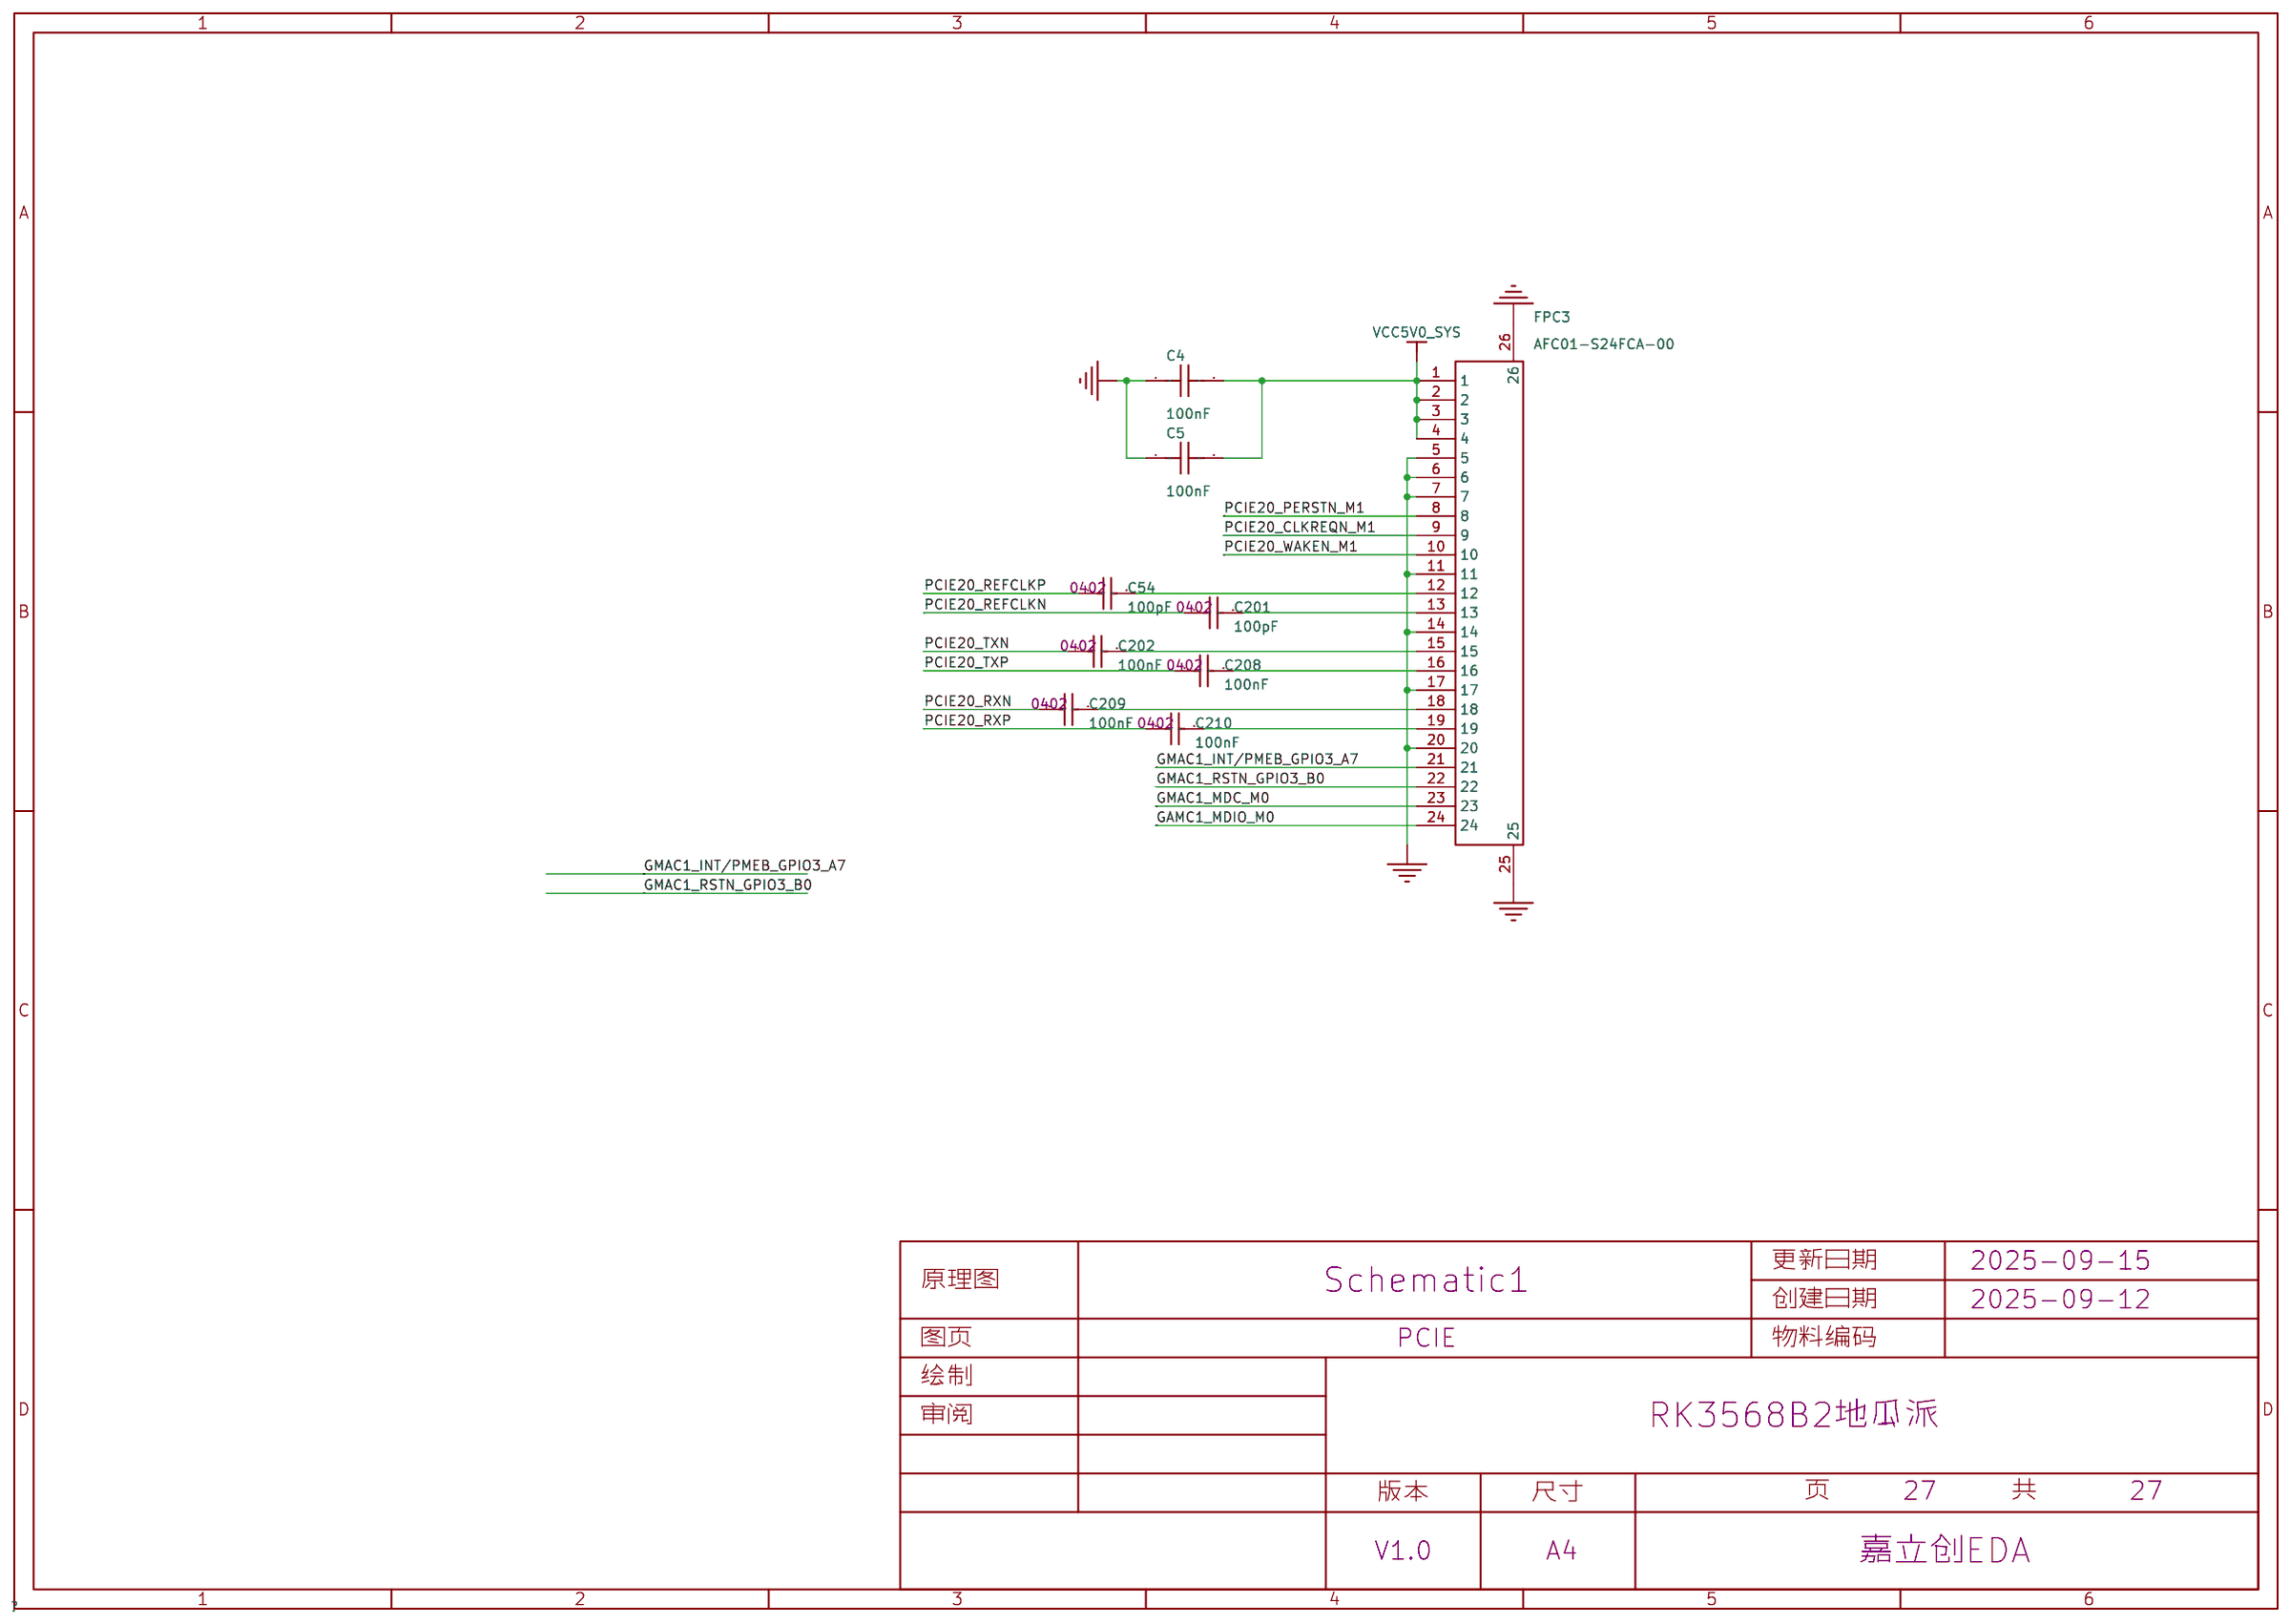
[diagram p7: PCIE]
9 HDMI: Create Date: 2025-09-11; Page Name: HDMI; Project Name: RK3568B2地瓜派; Update Date: 2025-09-11
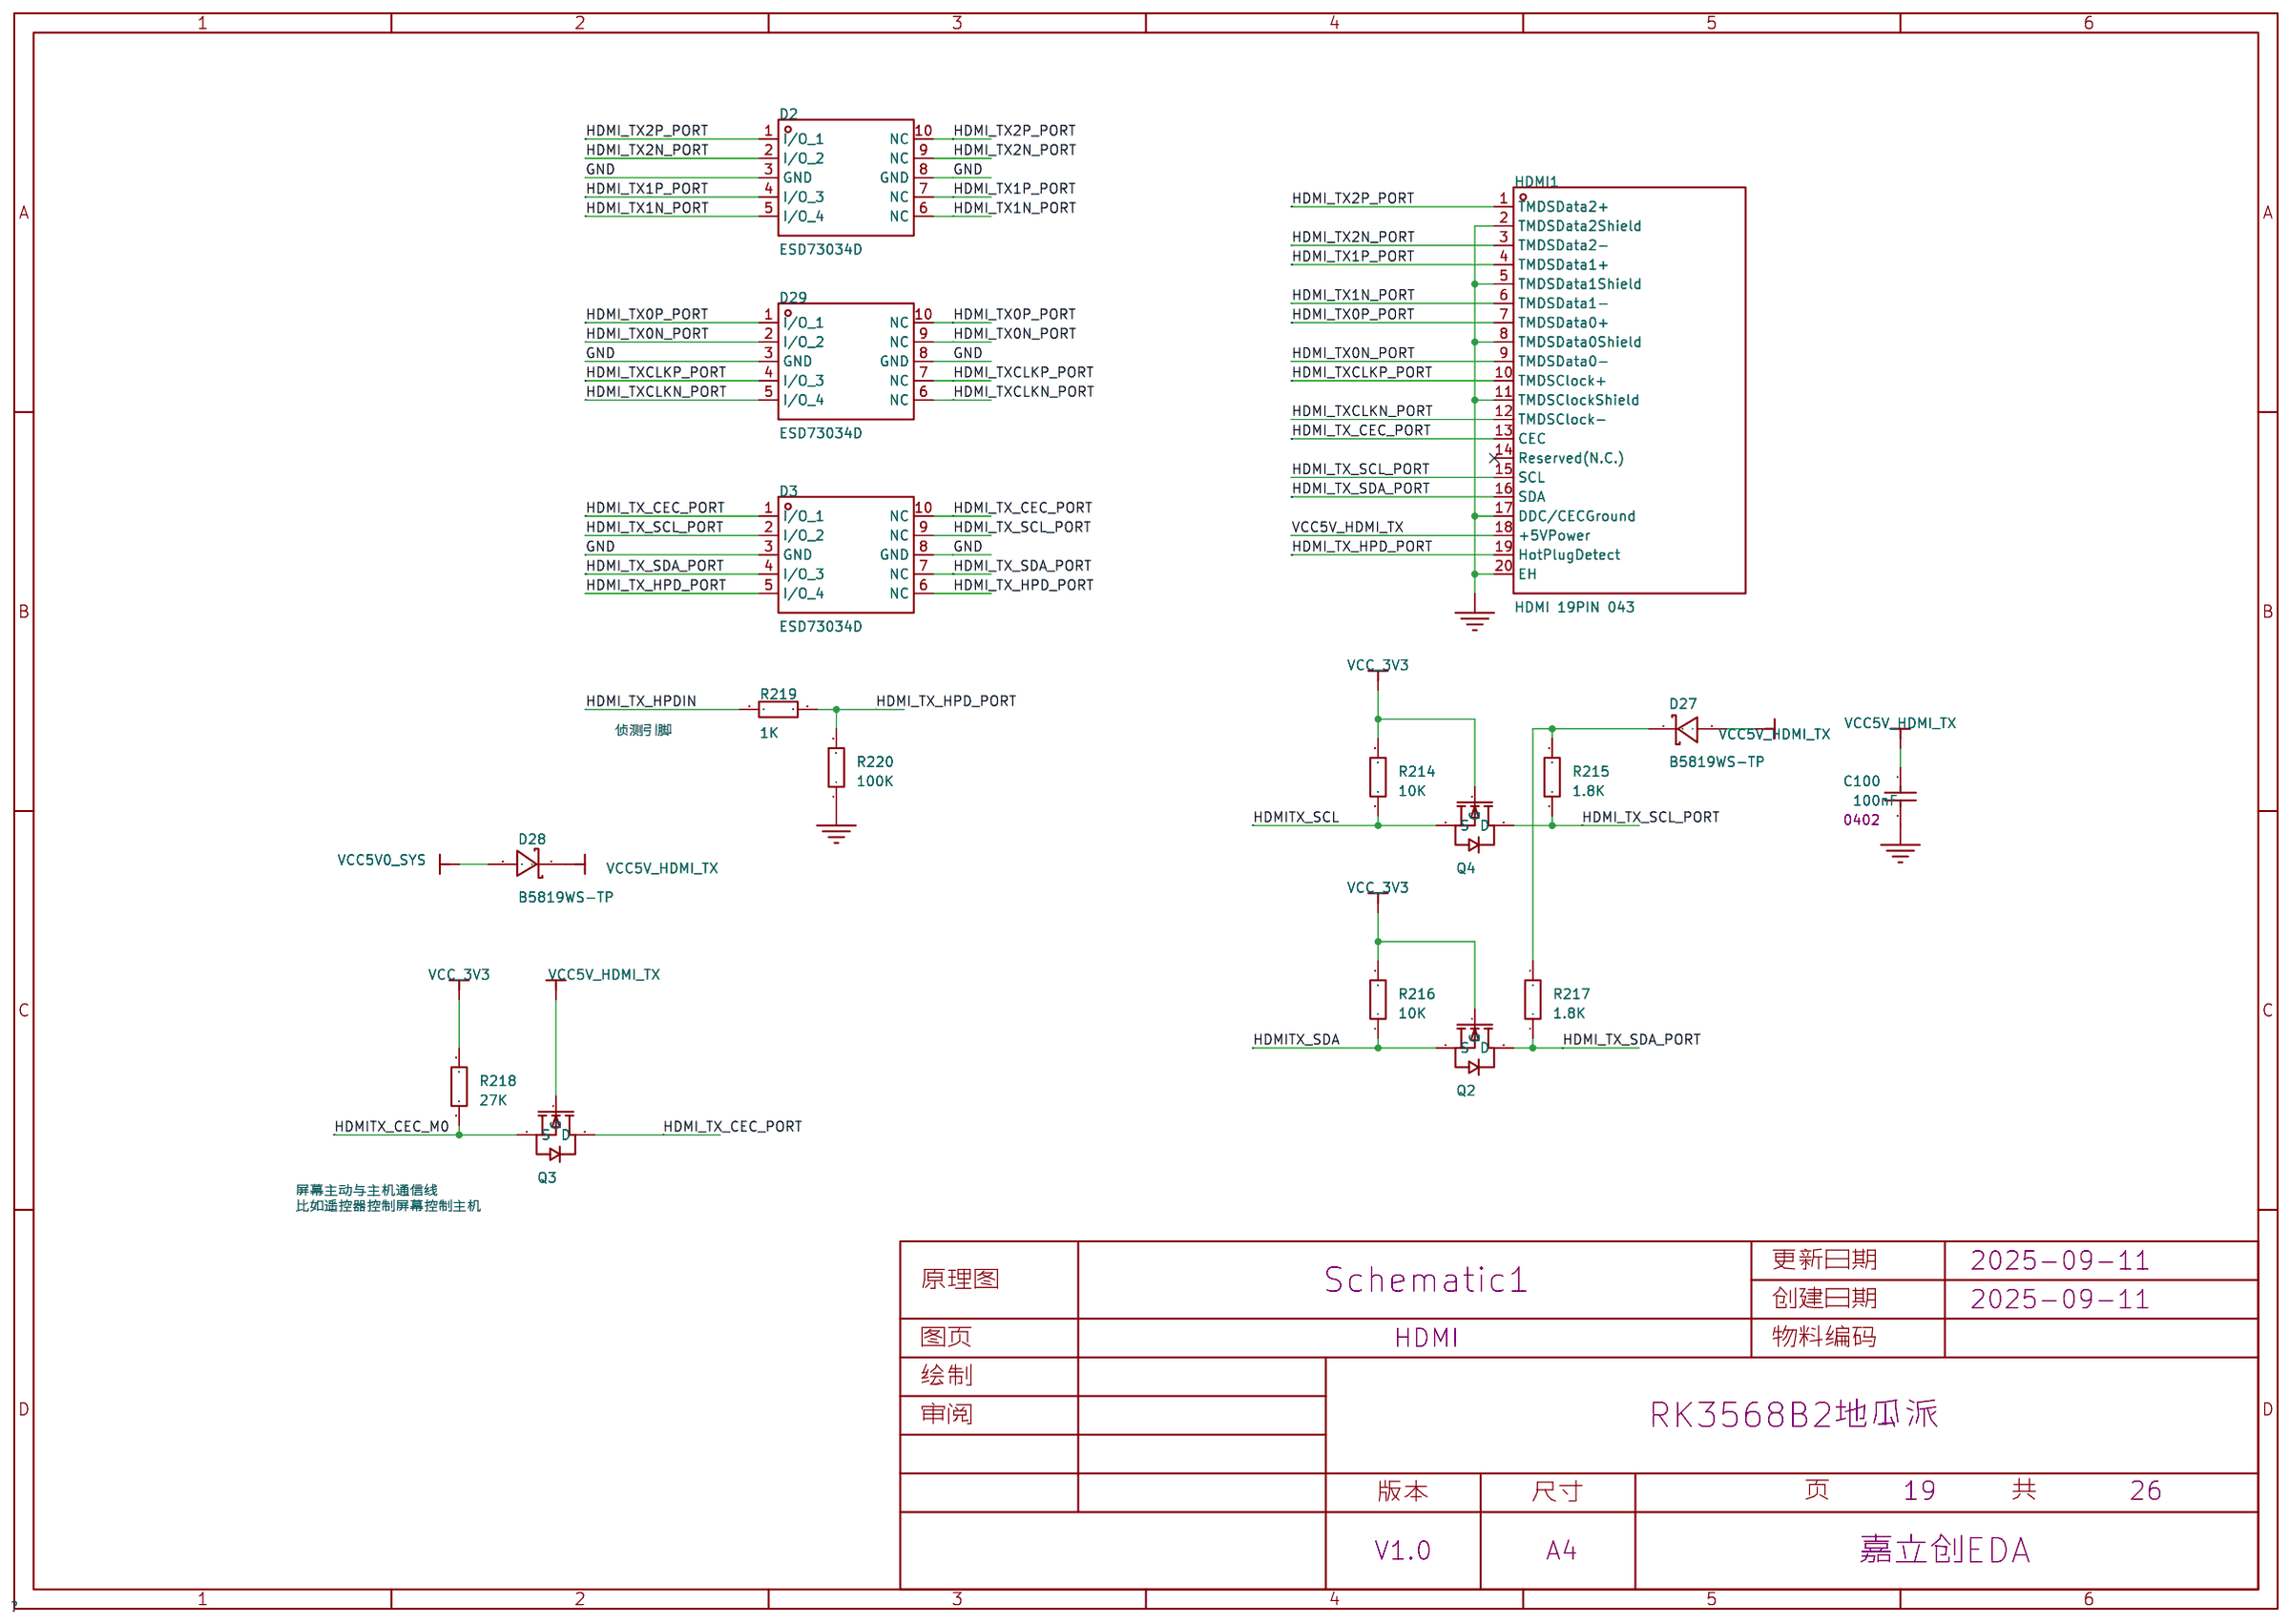
[diagram p8: HDMI]
10 USB: Create Date: 2025-09-11; Page Name: USB; Project Name: RK3568B2地瓜派; Update Date: 2025-09-15
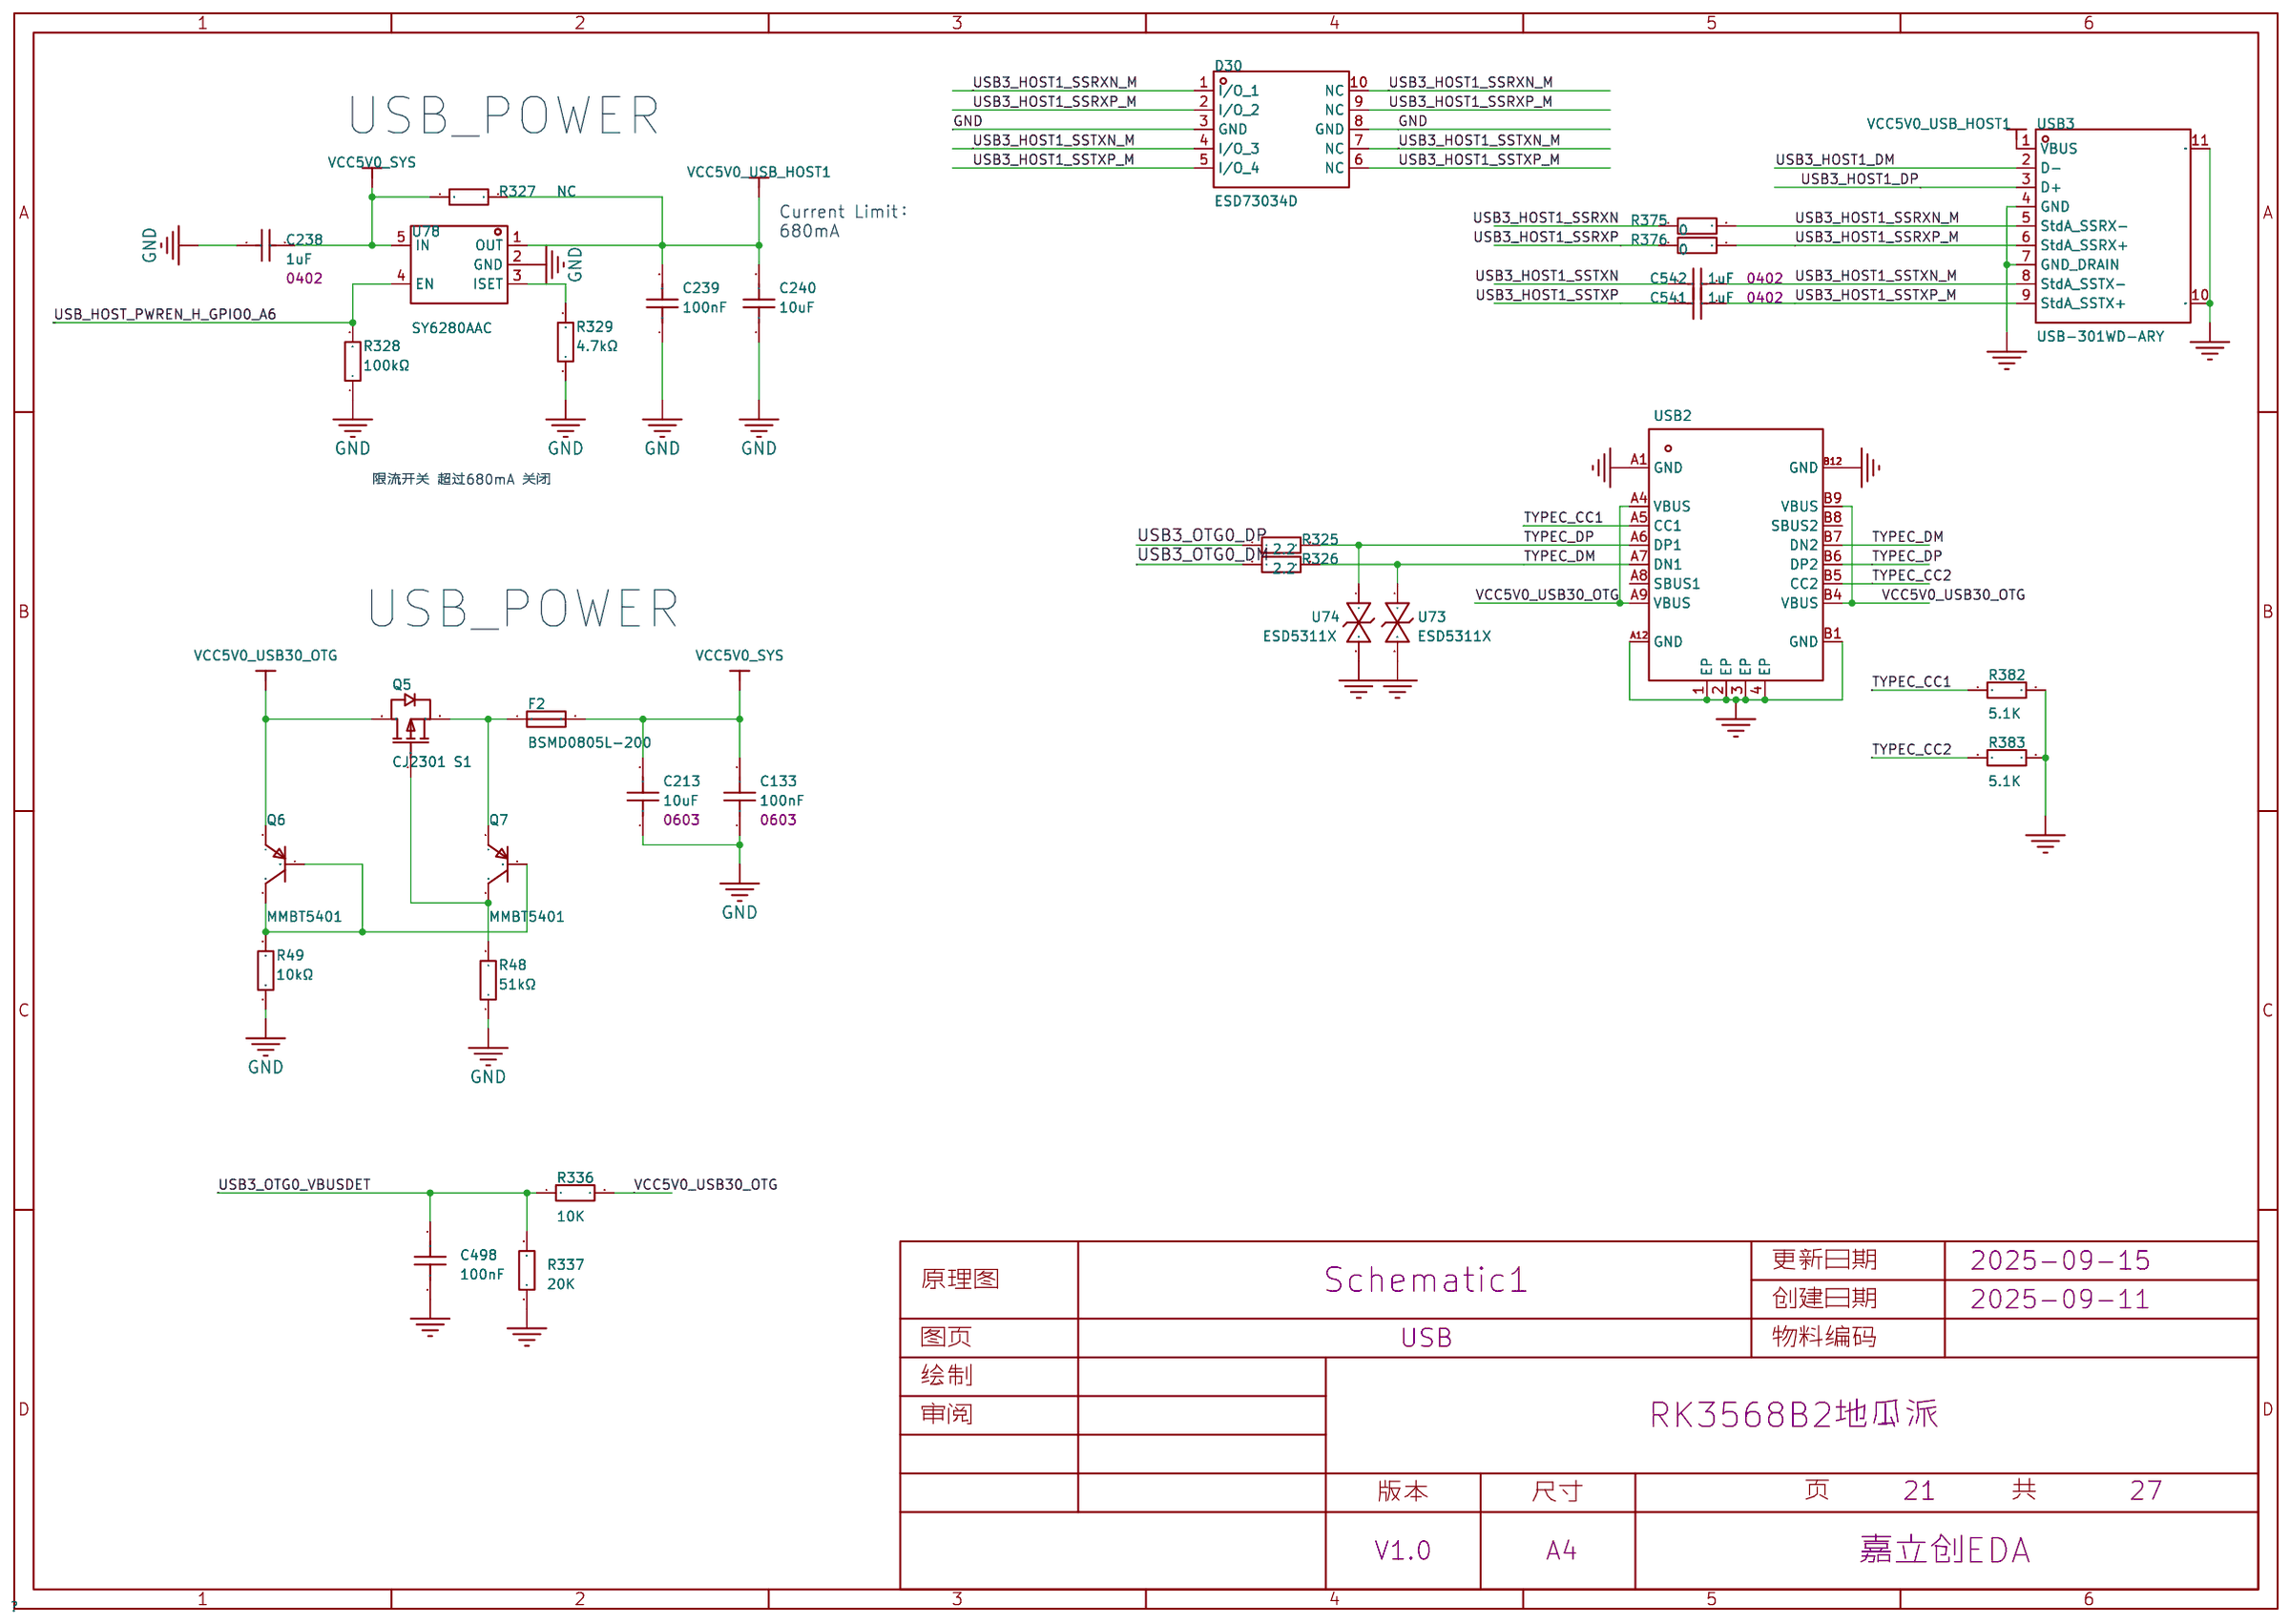
[diagram p9: USB]
11 CAM: Create Date: 2025-09-11; Page Name: CAM; Project Name: RK3568B2地瓜派; Update Date: 2025-09-11
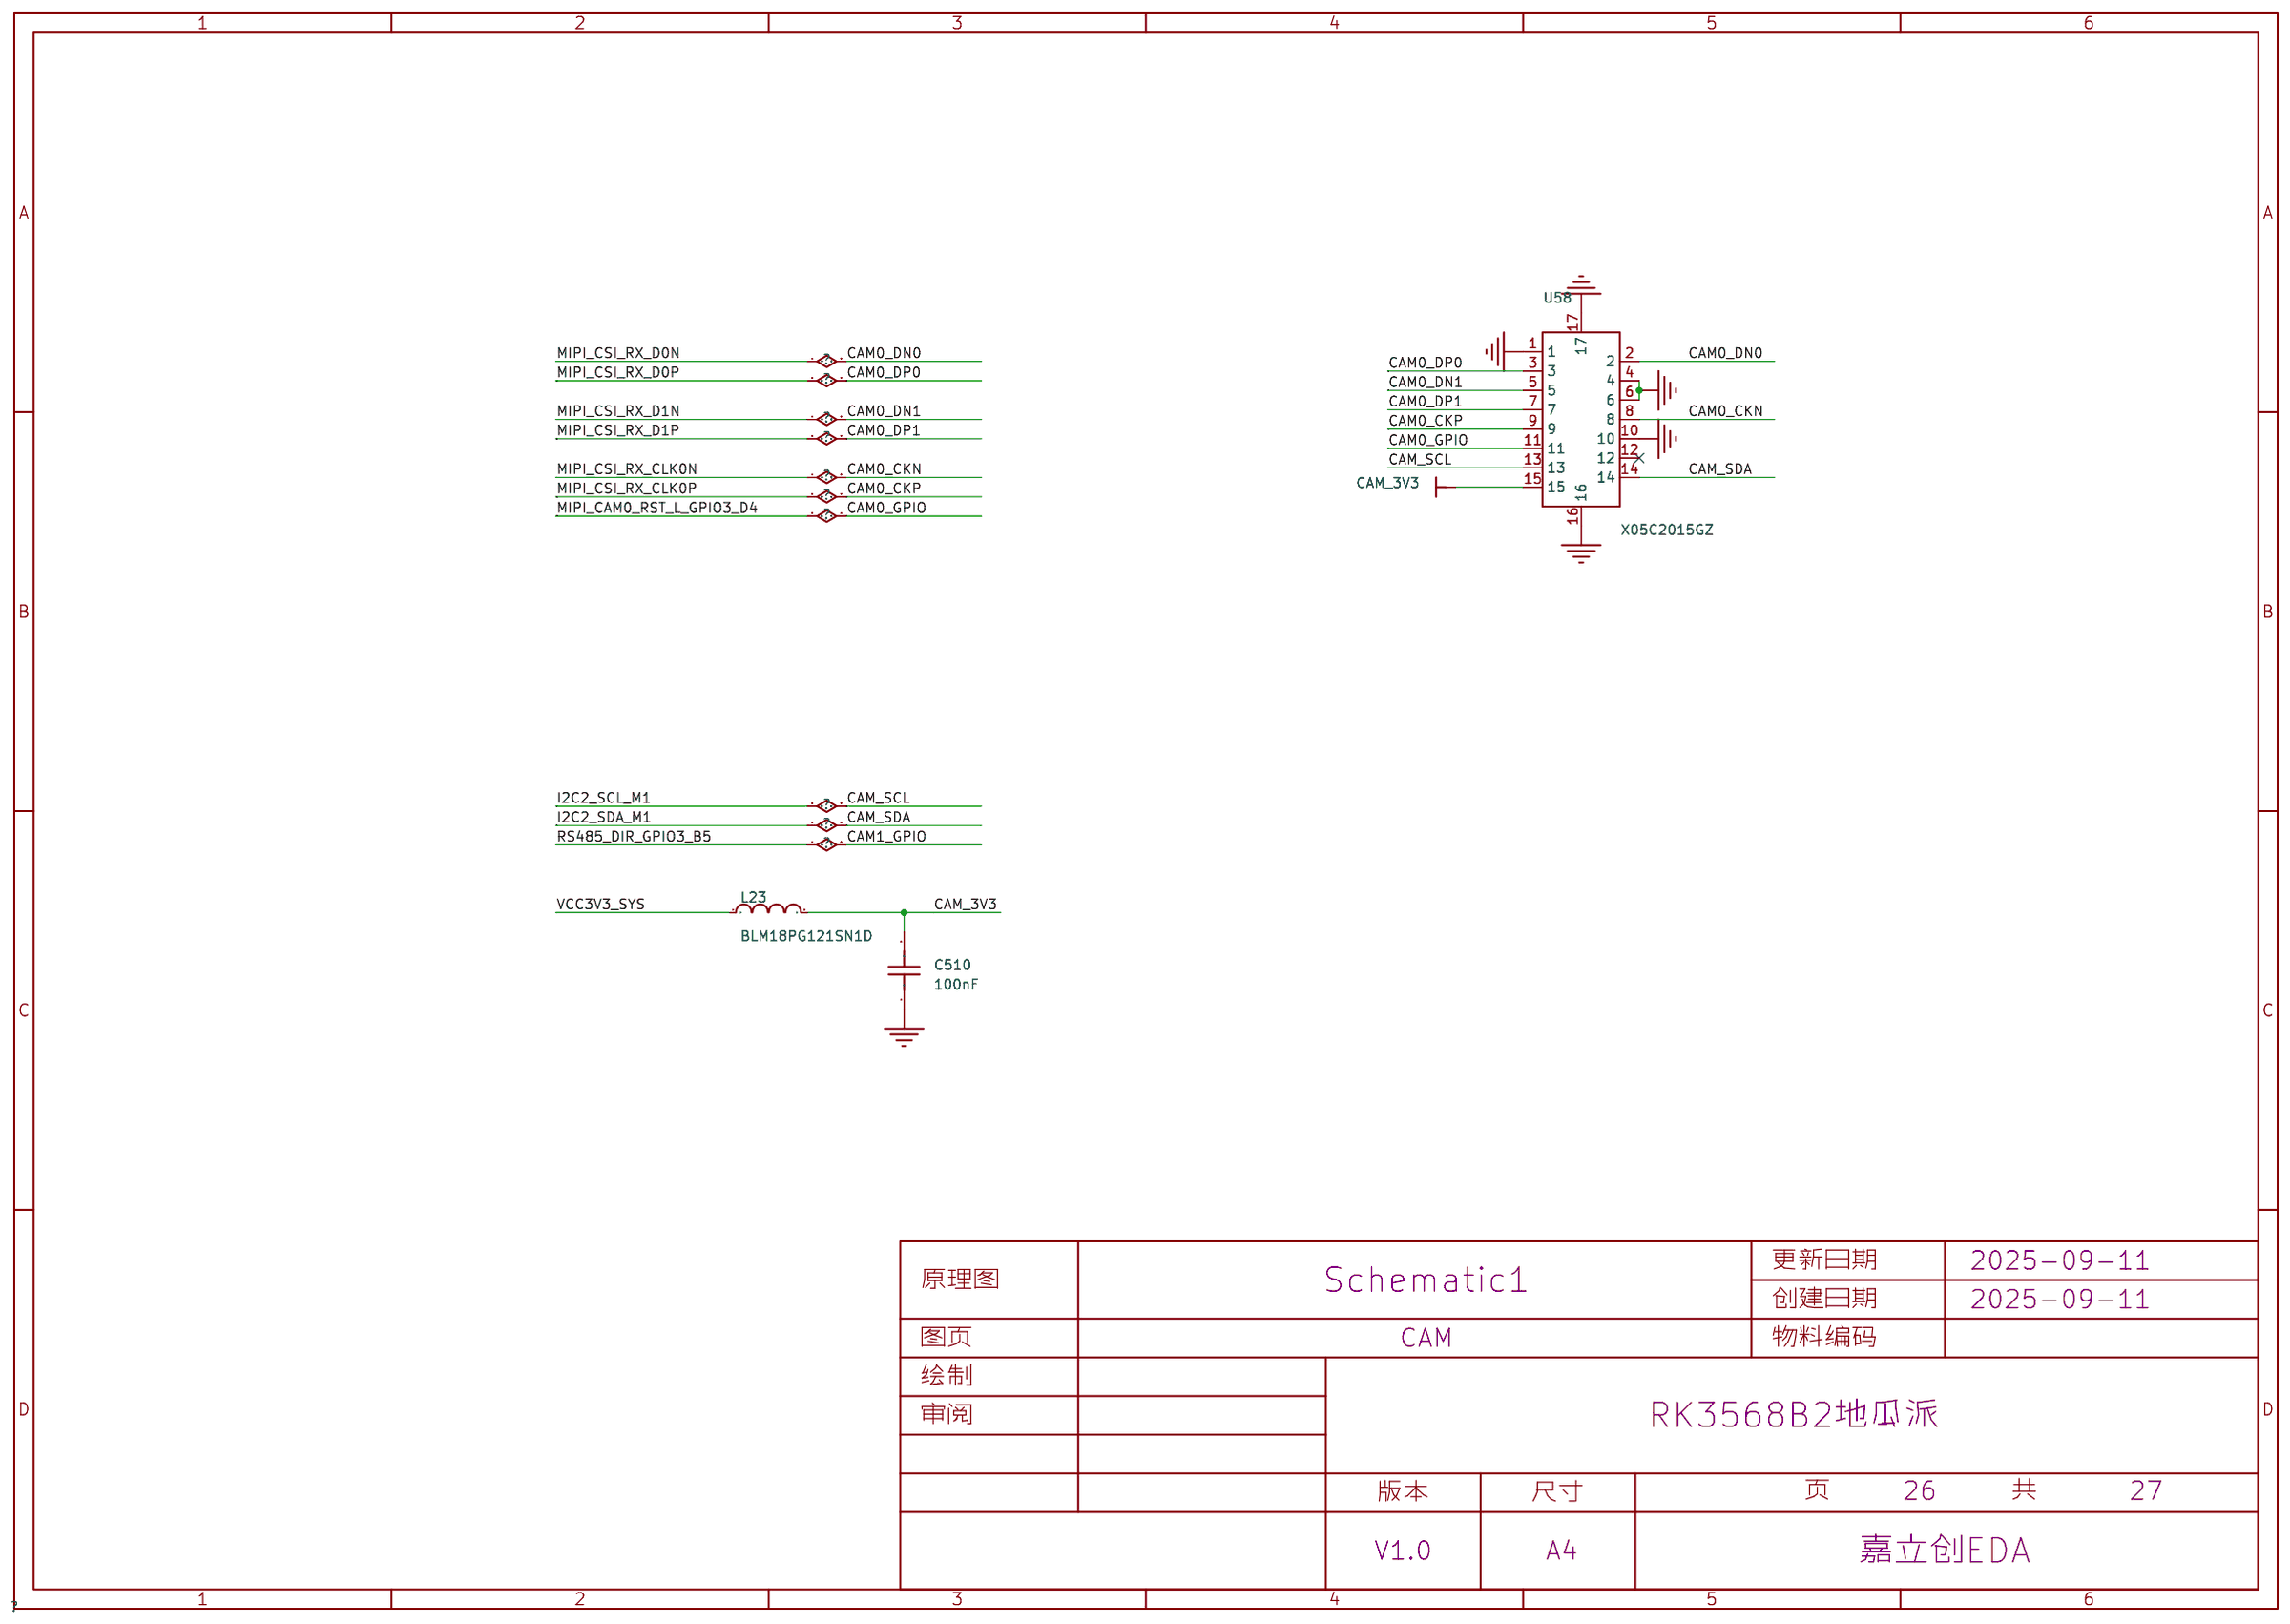
[diagram p10: CAM]
12 SD: Create Date: 2025-09-11; Page Name: SD; Project Name: RK3568B2地瓜派; Update Date: 2025-09-11
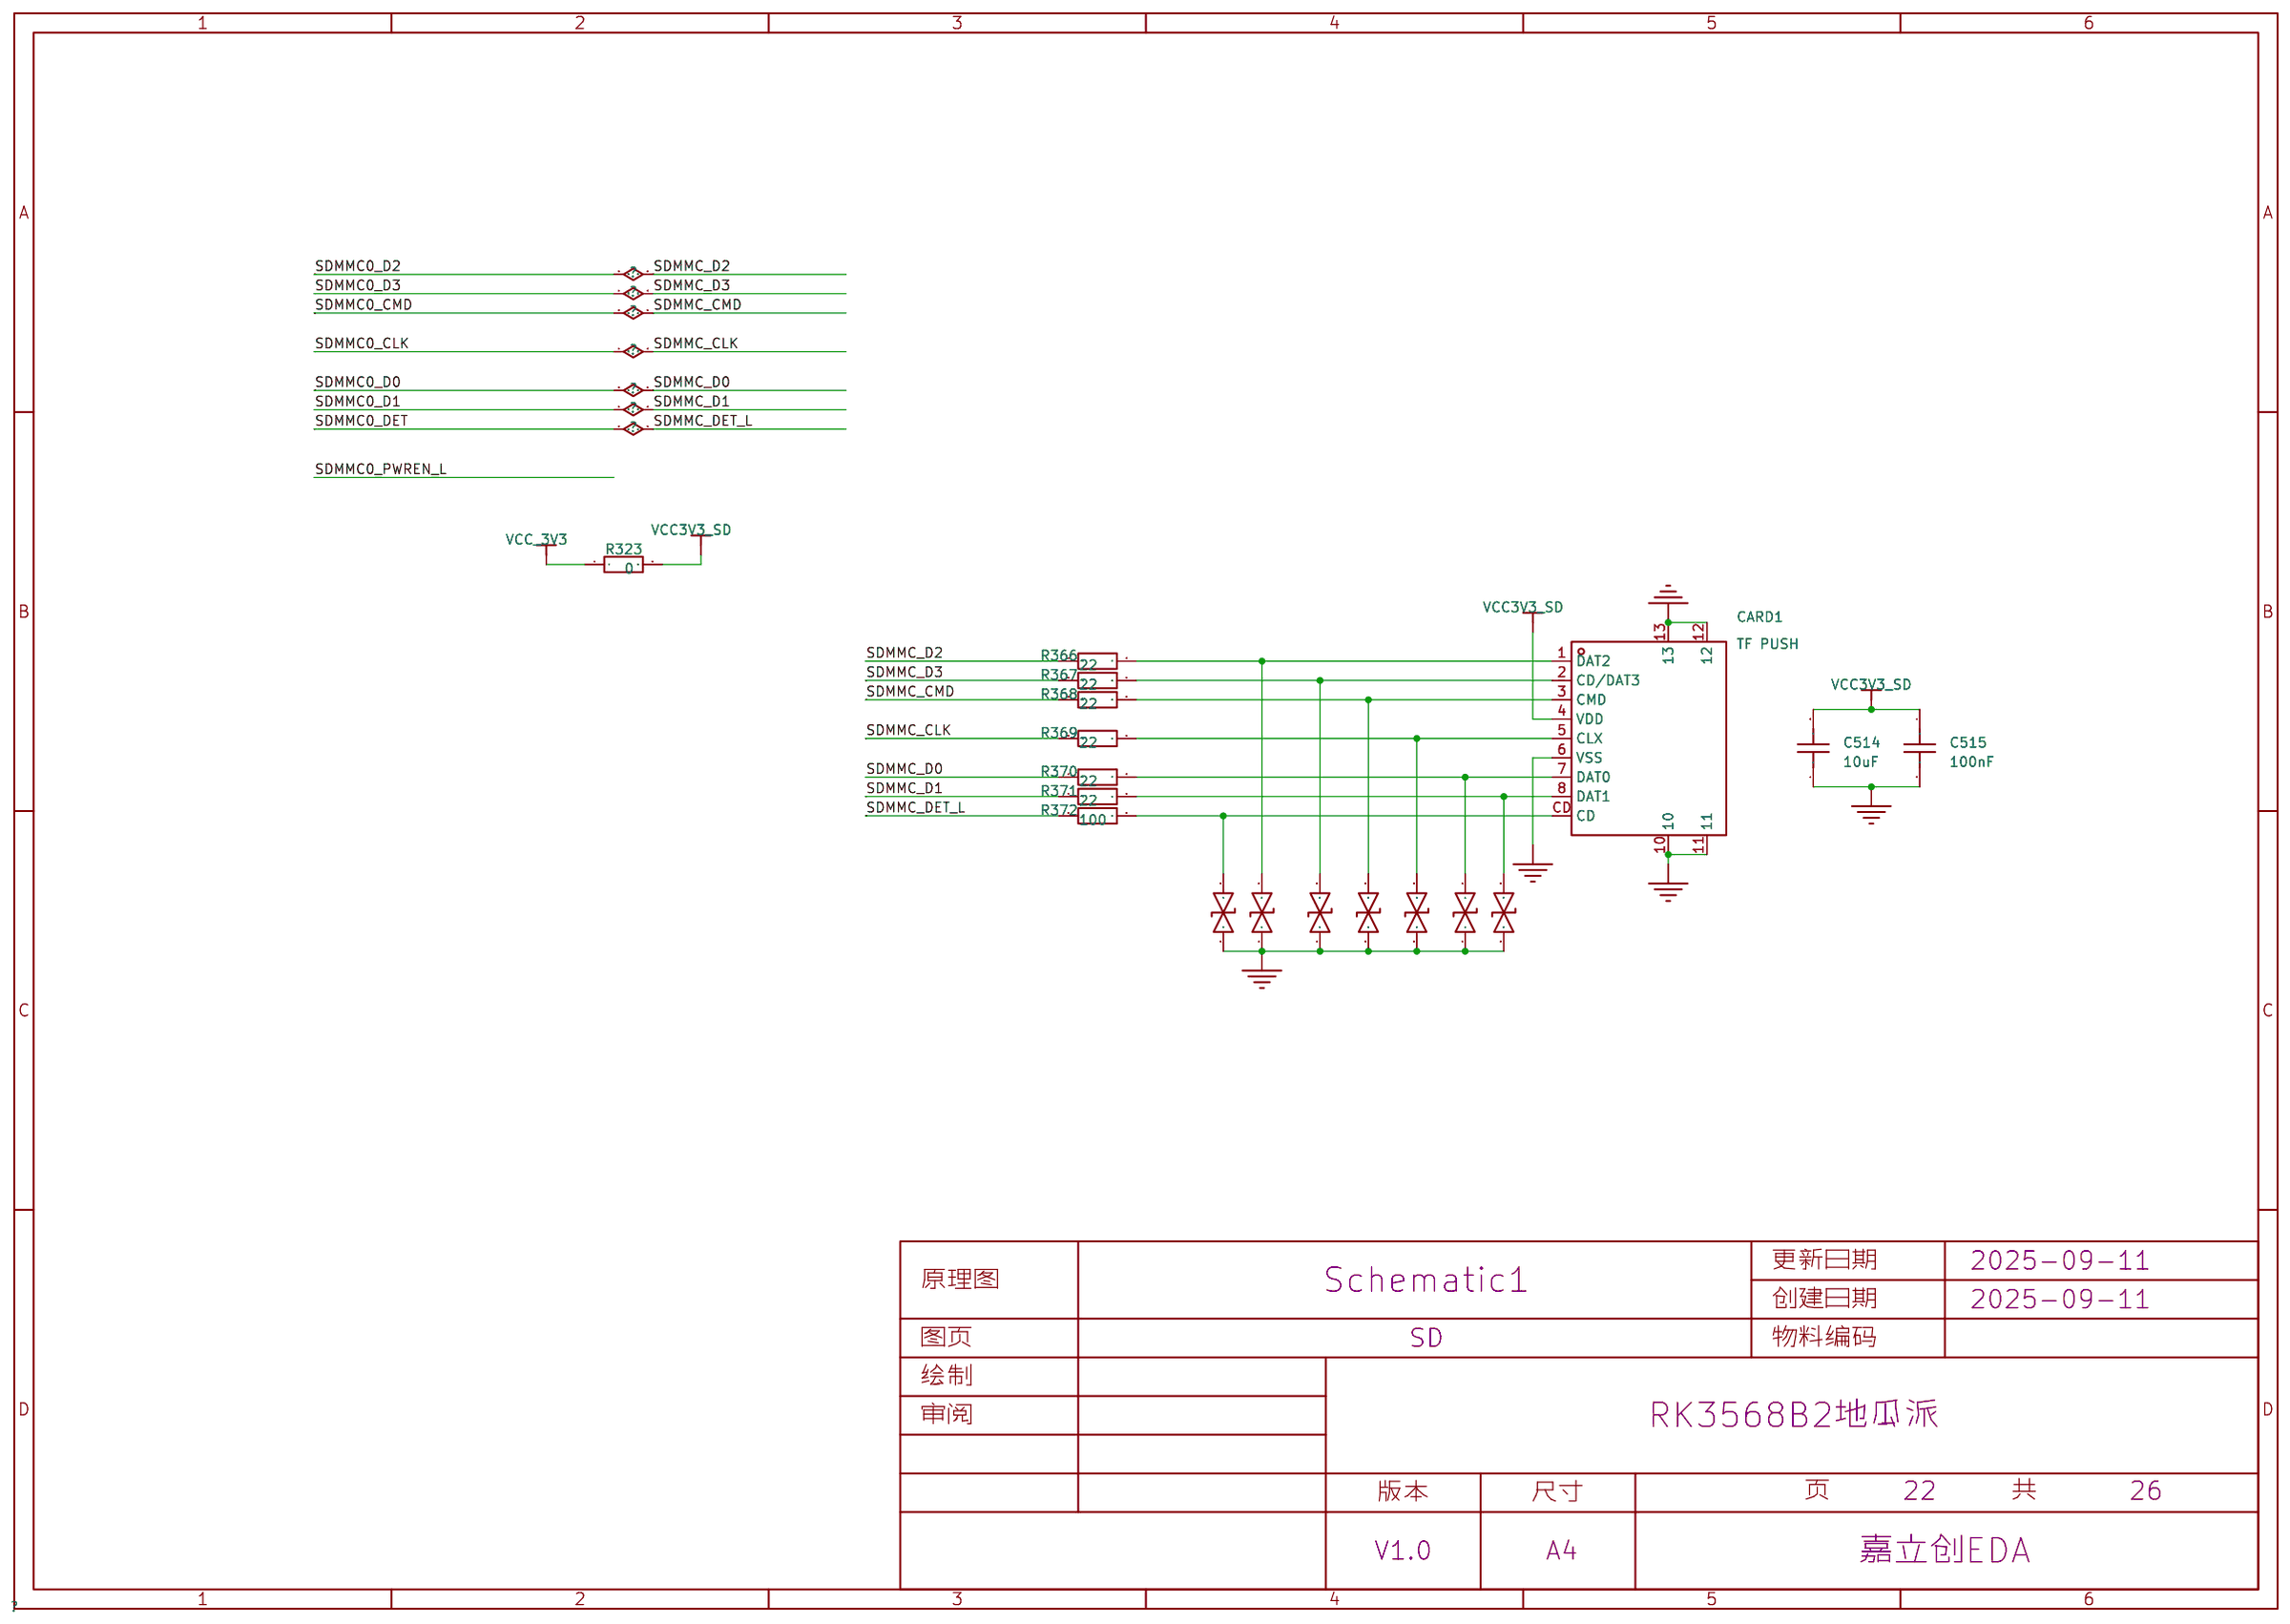
[diagram p11: SD]

## Parts
sheet CAM
C510  100nF  [C0603]
L23  BLM18PG121SN1D  [L0603_1]
U58  X05C2015GZ  [FPC-SMD_15P-P0.50_XKB_X05C2015GZ]
sheet HDMI
C100  100nF  [R0402_1]
D2  ESD73034D  [DFN-10_L2.5-W1.0-P0.50-BL-2]
D3  ESD73034D  [DFN-10_L2.5-W1.0-P0.50-BL-2]
D27  B5819WS-TP  [SOD-323_L1.8-W1.3-LS2.5-RD]
D28  B5819WS-TP  [SOD-323_L1.8-W1.3-LS2.5-RD]
D29  ESD73034D  [DFN-10_L2.5-W1.0-P0.50-BL-2]
HDMI1  HDMI 19PIN 043  [HDMI-SMD_HDMI-19PIN-043]
Q2  -  [SOT-23-3_L2.9-W1.3-P1.90-LS2.4-BR]
Q3  -  [SOT-23-3_L2.9-W1.3-P1.90-LS2.4-BR]
Q4  -  [SOT-23-3_L2.9-W1.3-P1.90-LS2.4-BR]
R214  10K  [R0402]
R215  1.8K  [R0402]
R216  10K  [R0402]
R217  1.8K  [R0402]
R218  27K  [R0402]
R219  1K  [R0402]
R220  100K  [R0402]
sheet KEY/LED
C110  100nF  [c0402-nsk]
H1  -  [HDR-TH_3P-P2.54-V-M]
PW  -  [LED_0402]
PW1  -  [LED_0402]
PW2  -  [LED_0402]
PWR  -  [Key_SMD_4.2x3.2x2.5]
Q1  PUMH9,115  [SOT-363_L2.0-W1.3-P0.65-LS2.1-BL]
R80  22  [R0402]
R81  22  [R0402]
R82  1K  [R0402]
R83  1K  [R0402]
R84  1K  [R0402]
R377  100  [R0402]
R378  100  [R0402]
RST  -  [Key_SMD_4.2x3.2x2.5]
U8  ESD5451N  [X1-DFN1006-2_L1.0-W0.6-P0.65-BI]
U9  ESD5451N  [X1-DFN1006-2_L1.0-W0.6-P0.65-BI]
U77  ESD5311X  [DFN1006-2L-BI]
U81  ESD5311X  [DFN1006-2L-BI]
sheet LPDDR4/4X
C139  10uF  [C0603_2]
C140  100nF  [R0402_1]
C141  100nF  [R0402_1]
C142  100nF  [R0402_1]
C143  100nF  [R0402_1]
C144  100nF  [R0402_1]
C145  100nF  [R0402_1]
C146  22uF  [C0603_1]
C147  10uF  [C0603_2]
C148  10uF  [C0603_2]
C149  1uF  [R0402_1]
C150  100nF  [R0402_1]
C151  100nF  [R0402_1]
C152  100nF  [R0402_1]
C153  100nF  [R0402_1]
C154  100nF  [R0402_1]
C155  100nF  [R0402_1]
C156  100nF  [R0402_1]
C157  100nF  [R0402_1]
C158  100nF  [R0402_1]
C159  100nF  [R0402_1]
C160  100nF  [R0402_1]
C161  100nF  [R0402_1]
C162  100nF  [R0402_1]
C163  100nF  [R0402_1]
C164  100nF  [R0402_1]
C165  100nF  [R0402_1]
C166  22uF  [C0603_1]
C167  10uF  [R0402_1]
C168  10uF  [R0402_1]
C169  100nF  [R0402_1]
C170  100nF  [R0402_1]
C171  100nF  [R0402_1]
C172  100nF  [R0402_1]
C173  100nF  [R0402_1]
C174  100nF  [R0402_1]
C175  100nF  [R0402_1]
C176  100nF  [R0402_1]
C177  100nF  [R0402_1]
C178  100nF  [R0402_1]
C179  100nF  [R0402_1]
C180  100nF  [R0402_1]
C181  100nF  [R0402_1]
C182  100nF  [R0402_1]
C183  100nF  [R0402_1]
R70  0Ω  [R0603_2]
R71  240  [r0402-nsk]
R72  240  [r0402-nsk]
U6  -  [LPDDR4_MrX]  (sections 1,2)
sheet PCIE
C4  100nF  [C0603]
C5  100nF  [C0603]
C54  100pF  [c0402-nsk]
C201  100pF  [c0402-nsk]
C202  100nF  [c0402-nsk]
C208  100nF  [c0402-nsk]
C209  100nF  [c0402-nsk]
C210  100nF  [c0402-nsk]
FPC3  AFC01-S24FCA-00  [FPC-SMD_24P-P0.50_AFC01-S24FCA-00]
sheet SD
C514  10uF  [C0603]
C515  100nF  [c0402-nsk]
CARD1  TF PUSH  [TF-SMD_TF-PUSH]
R323  0  [R0603]
R366  22  [R0402]
R367  22  [R0402]
R368  22  [R0402]
R369  22  [R0402]
R370  22  [R0402]
R371  22  [R0402]
R372  100  [R0402]
U52  ESD5341N  [DFN1006-2L-BI_1]
U53  ESD5341N  [DFN1006-2L-BI_1]
U54  ESD5341N  [DFN1006-2L-BI_1]
U55  ESD5341N  [DFN1006-2L-BI_1]
U56  ESD5341N  [DFN1006-2L-BI_1]
U57  ESD5341N  [DFN1006-2L-BI_1]
U80  ESD5341N  [DFN1006-2L-BI_1]
sheet SOC_CAM
C68  100nF  [C0201]
C69  100nF  [C0201]
sheet SOC_FLASH
C35  100nF  [C0201]
C36  100nF  [C0201]
R18  22  [R0402]
R27  22  [R0402]
R42  22  [R0402]
RST1  -  [Key_SMD_4.2x3.2x2.5]
U10  ESD5451N  [X1-DFN1006-2_L1.0-W0.6-P0.65-BI]
sheet SOC_LOGIC
C20  22pF  [c0402-nsk]
C21  100nF  [C0201]
C22  22pF  [c0402-nsk]
C23  100nF  [C0201]
C24  1uF  [c0402-nsk]
C25  100nF  [C0201]
C26  1uF  [c0402-nsk]
C27  100nF  [C0201]
C28  1uF  [C0402]
C29  100nF  [C0201]
C30  100nF  [C0201]
C31  1uF  [c0402-nsk]
C32  100nF  [C0201]
C33  100nF  [C0201]
C34  1uF  [c0402-nsk]
R1  22  [R0402]
R2  0Ω  [r0402-nsk]
R3  1M  [R0402]
R169  2K  [R0402]
R170  2K  [R0402]
R175  2.2K  [R0402]
R176  2.2K  [R0402]
U1  24MHz  [CRYSTAL-SMD_4P-L3.2-W2.5-BL]
sheet SOC_PWR
U4  -  [BGA-636_L19.0-W19.0-P0.65-BL]  (sections A,B,C,D,E,F,G,H,I,J,K,L,M,N,O,P,Q,R,S,T,U,V,W)
sheet USB
C133  100nF  [R0603]
C213  10uF  [R0603]
C238  1uF  [c0402-nsk]
C239  100nF  [R0603_1]
C240  10uF  [C0603_2]
C498  100nF  [c0402-nsk]
C541  1uF  [c0402-nsk]
C542  1uF  [c0402-nsk]
D30  ESD73034D  [DFN-10_L2.5-W1.0-P0.50-BL-2]
F2  BSMD0805L-200  [F0805]
Q5  CJ2301 S1  [SOT-23-3_L3.0-W1.7-P0.95-LS2.9-BR]
Q6  MMBT5401  [SOT-23-3_L2.9-W1.3-P1.90-LS2.4-BR]
Q7  MMBT5401  [SOT-23-3_L2.9-W1.3-P1.90-LS2.4-BR]
R48  51kΩ  [R0402]
R49  10kΩ  [R0402]
R325  2.2  [R0402]
R326  2.2  [R0402]
R327  NC  [R0805]  (no BOM)
R328  100kΩ  [R0402_1]
R329  4.7kΩ  [R0402_1]
R336  10K  [R0402]
R337  20K  [R0402]
R375  0  [R0402]
R376  0  [R0402]
R382  5.1K  [R0402]
R383  5.1K  [R0402]
U73  ESD5311X  [DFN1006-2L-BI]
U74  ESD5311X  [DFN1006-2L-BI]
U78  SY6280AAC  [SOT-23-5_L3.0-W1.7-P0.95-LS2.8-BL]
USB2  -  [USB_TYPE-C-16P]
USB3  USB-301WD-ARY  [USB-TH_XUNPU_USB-301WD-ARY]

## Library data of the parts
C4 C5 C510 C514 = CAP_0603: Supplier Footprint: 0603
L23 = BLM18PG121SN1D: 标称阻抗@测试频率:120Ω@100MHz;误差:±25%;直流电阻(RDC):50mΩ;; LCSC Part Name: 单路 0603磁珠 阻抗120Ω@100MHz; Supplier Part: C14709; Manufacturer: muRata(村田); Supplier Footprint: 0603; JLCPCB Part Class: 基础库; Datasheet: https://atta.szlcsc.com/upload/public/pdf/source/20130704/1457706621422.pdf; Supplier: LCSC; Impedance @ Frequency: 120Ω@100MHz; Tolerance: ±25%; DC Resistance: 50mΩ; Current Rating: 2A; Circuits: 1; DC Resistance(DCR): 50mΩ; Number of Circuits: 1; Operating Temperature: -55℃~+125℃
U58 = X05C2015GZ: 锁定特性:抽屉式;触点类型:单侧触点/垂直;触点数量:15P;间距:0.5mm;安装方式:立贴;工作温度:-40℃~+85℃;; LCSC Part Name: 间距:0.5mm P数:15P 抽屉式 单侧触点/垂直; Supplier Part: C2880899; Manufacturer: XKB Connection(中国星坤); Supplier Footprint: SMD,P=0.5mm; JLCPCB Part Class: 扩展库; Datasheet: https://atta.szlcsc.com/upload/public/pdf/source/20211011/FB814D820E44B2E0BC67EE682E3C499B.pdf; Supplier: LCSC; Locking Feature: 抽屉式; Contact Type: 单侧触点/垂直; Number of Contacts: 15P; Pitch: 0.5mm; Mounting Type: 立贴; FFC, FCB Thickness: 0.3mm; Height Above Board: 2mm; Contact Material: 磷青铜; Contact Plating: 金; Operating Temperature: -40℃~+85℃
C54 C100 C149 C201 C202 C208-C210 C238 C541 C542 = CL05A105KP5NNNC: 容值:1uF;精度:±10%;额定电压:10V;材质(温度系数):X5R;; LCSC Part Name: 1uF ±10% 10V; Supplier Part: C14445; Manufacturer: SAMSUNG(三星); Supplier Footprint: 0402; JLCPCB Part Class: 扩展库; Datasheet: https://atta.szlcsc.com/upload/public/pdf/source/20160103/1457707670698.pdf; Supplier: LCSC; Tolerance: ±10%; Voltage Rated: 10V; Temperature Coefficient: X5R
D2 D3 D29 D30 = ESD73034D: 极性:双向;反向截止电压(Vrwm):3.3V;钳位电压:18V;峰值脉冲电流(Ipp):3A@8/20us;峰值脉冲功率(Ppp):60W@8/20us;击穿电压:8.5V;; LCSC Part Name: ESD73034D-10/TR; Supplier Part: C7202962; Manufacturer: TECH PUBLIC(台舟); Supplier Footprint: DFN2510-10; JLCPCB Part Class: 扩展库; Datasheet: https://item.szlcsc.com/datasheet/ESD73034D/8170920.html; Supplier: LCSC; Polarity: 双向; Reverse Stand-Off Voltage (Vrwm): 3.3V; Clamping Voltage: 18V; Peak Pulse Current (Ipp): 3A@8/20us; Peak Pulse Power Dissipation (Ppp): 60W@8/20us; Voltage - Breakdown: 8.5V; Reverse Leakage Current (Ir): 200nA; Number of Channels: 四路; level of protection: IEC 61000-4-5；IEC 61000-4-2; Type: ESD; Junction Capacitance: 0.25pF
D27 D28 = B5819WS-TP: 正向压降(Vf):600mV@1A;直流反向耐压(Vr):40V;平均整流电流(Io):1A;; LCSC Part Name: 电压:40V 电流:1A; Supplier Part: C78734; Manufacturer: MCC(美微科); Supplier Footprint: SOD-323; JLCPCB Part Class: 扩展库; Datasheet: https://atta.szlcsc.com/upload/public/pdf/source/20190308/C78734_7BD7F562D63F05C7B4187010ADA330AA.pdf; Supplier: LCSC; Forward Voltage (Vf@If): 600mV@1A; Reverse Voltage (Vr): 40V; Average Rectified Current (Io): 1A; Reverse Leakage Current (Ir): 1mA@40V
HDMI1 = HDMI 19PIN 043: USB母座/HD-MI 19PIN母座 4脚插件 贴片19PIN 铁壳镀镍; Supplier Part: C2858275; Manufacturer: SHOU HAN(首韩); Supplier Footprint: SMD; JLCPCB Part Class: 扩展库; Datasheet: https://atta.szlcsc.com/upload/public/pdf/source/20210728/C2858275_DF299413048A9CF092C2A61AB97004F4.pdf; Supplier: LCSC; Connector Type: HDMI-A; Gender: 母; Number of Pins: 19P; Mounting Style: 卧贴; Current Rating (Max): 300mA; Rated Voltage (Max): 40V; Operating Temperature Range: -55℃~+85℃
Q2-Q4 = AO3400A_N: 类型:N沟道;漏源电压(Vdss):30V;连续漏极电流(Id):5.2A;功率(Pd):1W;导通电阻(RDS(on)@Vgs,Id):35mΩ@10V,5A;阈值电压(Vgs(th)@Id):1.5V@250μA;; Supplier Footprint: SOT-23; Supplier Part: C700953
R1 R3 R18 R27 R42 R80-R84 R169 R170 R175 R176 R214-R220 R325 R326 R336 R337 R366-R372 R375-R378 R382 R383 = Res_0402: Supplier Footprint: 0402
C31 C110 C239 = CC0603KRX7R9BB104: 容值:100nF;精度:±10%;额定电压:50V;材质(温度系数):X7R;; LCSC Part Name: 100nF ±10% 50V; Supplier Part: C14663; Manufacturer: YAGEO(国巨); Supplier Footprint: 0603; JLCPCB Part Class: Basic Part; Datasheet: https://atta.szlcsc.com/upload/public/pdf/source/20180910/C282072_33301C7F631E79921B82A8DAC6BCC5B3.pdf; Supplier: LCSC; Tolerance: ±10%; Voltage Rated: 50V; Temperature Coefficient: X7R
H1 = HDR-M_2.54_1x3P: Supplier Part: C2937625; Supplier Footprint: 插件
PW PW1 PW2 = LED_0402-R: Supplier Footprint: 0402
PWR RST RST1 = Key_SMD_4.2x3.2x2.5: Supplier Footprint: SMD
Q1 = PUMH9,115: 晶体管类型:-;集射极击穿电压(Vceo):50V;集电极电流(Ic):100mA;功率(Pd):200mW;直流电流增益(hFE@Ic,Vce):100@5mA,5V;; LCSC Part Name: 耐压:50V 电流:100mA; Supplier Part: C426876; Manufacturer: Nexperia(安世); Supplier Footprint: SOT-363; JLCPCB Part Class: 扩展库; Datasheet: https://atta.szlcsc.com/upload/public/pdf/source/20240724/03256FD06240C401B0BD478BA06DFF99.pdf; Supplier: LCSC; Collector-Emitter Breakdown Voltage (Vceo): 50V; Collector Current (Ic): 100mA; Power Dissipation (Pd): 200mW; DC Current Gain (hFE@Ic,Vce): 100@5mA,5V; Input Voltage (VI(on)@Ic,Vce): 800mV@1mA,0.3V; Input Voltage (VI(off)@Ic,Vce): 700mV@100uA,5V; Input Resistor: 10kΩ; Resistor Ratio: 4.7; Operating Temperature: -55℃~+150℃
U8-U10 = ESD5451N_C2936977: 极性:双向;反向截止电压(Vrwm):5V;钳位电压:13V;峰值脉冲电流(Ipp):5.5A;峰值脉冲功率(Ppp):90W;击穿电压:8.4V;; LCSC Part Name: ESD二极管; Supplier Part: C2936977; Manufacturer: TECH PUBLIC(台舟); Supplier Footprint: DFN1006-2; JLCPCB Part Class: 扩展库; Datasheet: https://item.szlcsc.com/datasheet/ESD5451N/3290324.html; Supplier: LCSC; Polarity: 双向; Reverse Stand-Off Voltage (Vrwm): 5V; Clamping Voltage: 13V; Peak Pulse Current (Ipp): 5.5A; Peak Pulse Power Dissipation (Ppp): 90W; Voltage - Breakdown: 8.4V; Reverse Leakage Current (Ir): 80nA; Number of Channels: 单路; Operating Temperature: -55℃~+125℃; level of protection: IEC 61000-4-2; Type: ESD
U73 U74 U77 U81 = ESD5311X_C2844730: 极性:双向;反向截止电压(Vrwm):5V;最大钳位电压:21V;峰值脉冲电流(Ipp):4A;峰值脉冲功率(Ppp):80W;击穿电压:7.5V;; Supplier Part: C2844730; Manufacturer: TECH PUBLIC(台舟); Supplier Footprint: DFN1006-2; JLCPCB Part Class: 扩展库; Datasheet: https://atta.szlcsc.com/upload/public/pdf/source/20210709/C2844730_C8067B3CCE558E7D499244211FB5DC21.pdf; Supplier: LCSC; polarity: 双向; Reverse Stand-Off Voltage (Vrwm): 5V; Maximum Clamping Voltage: 21V; Peak Pulse Current (Ipp): 4A; Peak Pulse Power Dissipation (Ppp): 80W; Breakdown Voltage: 7.5V; Reverse Leakage Current (Ir): 80nA; Number of Lines: 单路; Operating Temperature: -55℃~+125℃; level of protection: IEC 61000-4-2; Type: ESD
C139 C147 C148 C213 C240 = CL10A106KP8NNNC: 容值:10uF;精度:±10%;额定电压:10V;材质(温度系数):X5R;; LCSC Part Name: 10uF ±10% 10V; Supplier Part: C19702; Manufacturer: SAMSUNG(三星); Supplier Footprint: 0603; JLCPCB Part Class: Basic Part; Datasheet: https://atta.szlcsc.com/upload/public/pdf/source/20160103/1457707703378.pdf; Supplier: LCSC; Tolerance: ±10%; Voltage Rated: 10V; Temperature Coefficient: X5R
C28 C140-C145 C150-C165 C169-C183 = CL05B104KB54PNC: 容值:100nF;精度:±10%;额定电压:50V;材质(温度系数):X7R;; LCSC Part Name: 100nF ±10% 50V; Supplier Part: C307331; Manufacturer: SAMSUNG(三星); Supplier Footprint: 0402; JLCPCB Part Class: Basic Part; Datasheet: https://atta.szlcsc.com/upload/public/pdf/source/20181009/C307331_222F7C870FD3EA5F46F538B483443886.pdf; Supplier: LCSC; Tolerance: ±10%; Voltage Rated: 50V; Temperature Coefficient: X7R
C146 C166 = CL10A226MQ8NRNC: 容值:22uF;精度:±20%;额定电压:6.3V;材质(温度系数):X5R;; LCSC Part Name: 22uF ±20% 6.3V; Supplier Part: C59461; Manufacturer: SAMSUNG(三星); Supplier Footprint: 0603; JLCPCB Part Class: Basic Part; Datasheet: https://atta.szlcsc.com/upload/public/pdf/source/20160218/1457707763339.pdf; Supplier: LCSC; Tolerance: ±20%; Voltage Rated: 6.3V; Temperature Coefficient: X5R
C167 C168 = CL05A106MQ5NUNC: 容值:10uF;精度:±20%;额定电压:6.3V;材质(温度系数):X5R;; LCSC Part Name: 10uF ±20% 6.3V; Supplier Part: C15525; Manufacturer: SAMSUNG(三星); Supplier Footprint: 0402; JLCPCB Part Class: Basic Part; Datasheet: https://atta.szlcsc.com/upload/public/pdf/source/20220823/2B02EE04F8F211D38A52DCB16EB6BEBA.pdf; Supplier: LCSC; Tolerance: ±20%; Voltage Rated: 6.3V; Temperature Coefficient: X5R
R70 = 0603WAF0000T5E: 电阻类型:厚膜电阻;阻值:0Ω;精度:±1%;功率:100mW;最大工作电压:75V;工作温度范围:-55℃~+155℃;; LCSC Part Name: 0Ω ±1% 100mW; Supplier Part: C21189; Manufacturer: UNI-ROYAL(厚声); Supplier Footprint: 0603; JLCPCB Part Class: Basic Part; Datasheet: https://atta.szlcsc.com/upload/public/pdf/source/20200306/C422600_1E6D84923E4A46A82E41ADD87F860B5C.pdf; Supplier: LCSC; Type: 厚膜电阻; Tolerance: ±1%; Power(Watts): 100mW; Overload Voltage (Max): 75V; Operating Temperature Range: -55℃~+155℃
R71 R72 = Res_0402: Supplier Footprint: 0402; Check: false
U6 = LPDDR4: Check: false
FPC3 = AFC01-S24FCA-00: 锁定特性:翻盖式;触点类型:下接;触点数量:24P;间距:0.5mm;安装方式:卧贴;; LCSC Part Name: 间距:0.5mm P数:24P 翻盖式 下接; Supplier Part: C262669; Manufacturer: JS(钜硕电子); Supplier Footprint: SMD,P=0.5mm,卧贴; JLCPCB Part Class: 扩展库; Datasheet: https://item.szlcsc.com/datasheet/AFC01-S24FCA-00/253928.html; Supplier: LCSC; Locking Feature: 翻盖式; Contact Type: 下接; Number of Contacts: 24P; Pitch: 0.5mm; Mounting Type: 卧贴; FFC, FCB Thickness: 0.3mm; Height Above Board: 2mm
C24 C26 C34 C498 C515 = CL10A105KB8NNNC: 容值:1uF;精度:±10%;额定电压:50V;材质(温度系数):X5R;; LCSC Part Name: 1uF ±10% 50V; Supplier Part: C15849; Manufacturer: SAMSUNG(三星); Supplier Footprint: 0603; JLCPCB Part Class: Basic Part; Datasheet: https://atta.szlcsc.com/upload/public/pdf/source/20160103/1457707679084.pdf; Supplier: LCSC; Tolerance: ±10%; Voltage Rated: 50V; Temperature Coefficient: X5R
CARD1 = TF PUSH: 卡连接方式:自弹式;卡类型:MicroSD卡(TF卡);连接器类型:卡座;本体最大高度:2mm;工作温度范围:-20℃~+90℃;; LCSC Part Name: 自弹式 MicroSD卡(TF卡) 卡座; Supplier Part: C393941; Manufacturer: SHOU HAN(首韩); Supplier Footprint: SMD; JLCPCB Part Class: 扩展库; Datasheet: https://atta.szlcsc.com/upload/public/pdf/source/20191011/C393941_0DDD896EE907FEB750D8B7B8982E2A67.pdf; Supplier: LCSC; Card Connection Mode: 自弹式; Card Type: MicroSD卡(TF卡); Connector Type: 卡座; Additional Card Detection Pins: 无; Maximum Body Height: 2mm; Operating Temperature Range: -20℃~+90℃
R323 = Res_0603: Supplier Footprint: 0603
U52-U57 U80 = ESD5341N_C20612964: LCSC Part Name: ESD静电保护管; Supplier Part: C20612964; Manufacturer: KUU; Supplier Footprint: DFN1006-2L; JLCPCB Part Class: 扩展库; Datasheet: https://atta.szlcsc.com/upload/public/pdf/source/20240126/9EE8C033ACD76A81C21292FAA1DFE4C1.pdf; Supplier: LCSC
C21 C23 C25 C27 C29 C30 C32 C33 C35 C36 C68 C69 = GRM035R60J475ME15D: 容值:4.7uF;精度:±20%;额定电压:6.3V;温度系数:X5R;; LCSC Part Name: 4.7uF ±20% 6.3V; Supplier Part: C335103; Manufacturer: muRata(村田); Supplier Footprint: 0201; JLCPCB Part Class: Extended Part; Datasheet: https://item.szlcsc.com/datasheet/GRM035R60J475ME15D/313624.html; Supplier: LCSC; Tolerance: ±20%; Voltage Rating: 6.3V; Temperature Coefficient: X5R
C20 C22 = CL10C120JB8NNNC: 容值:12pF;精度:±5%;额定电压:50V;材质(温度系数):C0G;; LCSC Part Name: 12pF ±5% 50V; Supplier Part: C38523; Manufacturer: SAMSUNG(三星); Supplier Footprint: 0603; JLCPCB Part Class: Basic Part; Datasheet: https://atta.szlcsc.com/upload/public/pdf/source/20160218/1457707763339.pdf; Supplier: LCSC; Tolerance: ±5%; Voltage Rated: 50V; Temperature Coefficient: C0G
R2 = 0402WGF0000TCE: 电阻类型:厚膜电阻;阻值:0Ω;精度:±1%;功率:62.5mW;; LCSC Part Name: 0Ω ±1% 62.5mW; Supplier Part: C17168; Manufacturer: UNI-ROYAL(厚声); Supplier Footprint: 0402; JLCPCB Part Class: Basic Part; Datasheet: https://atta.szlcsc.com/upload/public/pdf/source/20200306/C422600_1E6D84923E4A46A82E41ADD87F860B5C.pdf; Supplier: LCSC; Type: 厚膜电阻; Tolerance: ±1%; Power(Watts): 62.5mW; Temperature Coefficient: ±800ppm/℃; Overload Voltage (Max): 50V; Operating Temperature Range: -55℃~+155℃
U1 = 3225 24M 12PF 10PPM: 频率:24MHz;常温频差:±10ppm;外接负载电容:12pF;频率稳定度(全温):±30ppm;; LCSC Part Name: 24MHz ±10ppm 12pF; Supplier Part: C5181479; Manufacturer: SST(索斯特); Supplier Footprint: SMD3225-4P; JLCPCB Part Class: 扩展库; Datasheet: https://atta.szlcsc.com/upload/public/pdf/source/20220927/6DE882D78314C64B49594C58A0BA2E52.pdf; Supplier: LCSC; Normal temperature Frequency Tolerance: ±10ppm; External load capacitor: 12pF; Frequency Stability(Full temperature range): ±30ppm; Operating Temperature: -20℃~+70℃
U4 = RK3568
C133 = CC0603KRX7R9BB104: 容值:100nF;精度:±10%;额定电压:50V;材质(温度系数):X7R;; LCSC Part Name: 100nF ±10% 50V; Supplier Part: C14663; Manufacturer: YAGEO(国巨); Supplier Footprint: 0603; JLCPCB Part Class: Basic Part; Datasheet: https://atta.szlcsc.com/upload/public/pdf/source/20170116/1484561234239.pdf; Supplier: LCSC; Tolerance: ±10%; Voltage Rated: 50V; Temperature Coefficient: X7R
F2 = BSMD0805L-200: 最大电压:6V;最大电流:50A;保持电流:2A;跳闸电流:4A;; LCSC Part Name: 6V 2A 0805自恢复 5秒内动作; Supplier Part: C2757931; Manufacturer: BHFUSE(佰宏); Supplier Footprint: 0805; Datasheet: https://atta.szlcsc.com/upload/public/pdf/source/20220302/84A1D93E6CA84F7719C829CBF191FAF8.pdf; Supplier: LCSC; Operating Voltage (Max): 6V; Current Rating (Max): 50A; Hold Current: 2A; Trip Current: 4A; Power Dissipation: 1W; Resistance - Initial (Ri) (Min): 4mΩ; Resistance - Post Trip (R1) (Max): 45mΩ; Maximum Time to Trip: 5s; Operating Temperature: -40℃~+85℃
Q5 = CJ2301 S1: 类型:P沟道;漏源电压(Vdss):20V;连续漏极电流(Id):2.3A;功率(Pd):350mW;导通电阻(RDS(on)@Vgs,Id):112mΩ@4.5V,2.8A;; LCSC Part Name: P沟道 20V 2.3A; Supplier Part: C8547; Manufacturer: CJ(江苏长电/长晶); Supplier Footprint: SOT-23; JLCPCB Part Class: 扩展库; Datasheet: https://atta.szlcsc.com/upload/public/pdf/source/20140815/1457707224119.pdf; Supplier: LCSC; Type: P沟道; Drain Source Voltage (Vdss): 20V; Continuous Drain Current (Id): 2.3A; Power Dissipation (Pd): 350mW; Drain Source On Resistance (RDS(on)@Vgs,Id): 112mΩ@4.5V,2.8A; Gate Threshold Voltage (Vgs(th)@Id): 1V@250uA
Q6 Q7 = MMBT5401_C8326: 晶体管类型:PNP;集射极击穿电压(Vceo):150V;集电极电流(Ic):600mA;功率(Pd):300mW;集电极截止电流(Icbo):100nA;集电极-发射极饱和电压(VCE(sat)@Ic,Ib):500mV@50mA,5mA;直流电流增益(hFE@Ic,Vce):200@10mA,5V;特征频率(fT):100MHz;工作温度:+150℃@(Tj);; LCSC Part Name: PNP 150V 600mA; Supplier Part: C8326; Manufacturer: CJ(江苏长电/长晶); Supplier Footprint: SOT-23; Datasheet: https://atta.szlcsc.com/upload/public/pdf/source/20140809/1457707213644.pdf; Supplier: LCSC; Transistor Type: PNP; Collector-Emitter Breakdown Voltage (Vceo): 150V; Collector Current (Ic): 600mA; Power Dissipation (Pd): 300mW; Collector Cut-Off Current (Icbo): 100nA; Collector-Emitter Saturation Voltage (VCE(sat)@Ic,Ib): 500mV@50mA,5mA; DC Current Gain (hFE@Ic,Vce): 200@10mA,5V; Transition Frequency (fT): 100MHz; Operating Temperature: +150℃@(Tj)
R48 = 0402WGF5102TCE: 电阻类型:厚膜电阻;阻值:51kΩ;精度:±1%;功率:62.5mW;; LCSC Part Name: 51kΩ ±1% 62.5mW; Supplier Part: C25794; Manufacturer: UNI-ROYAL(厚声); Supplier Footprint: 0402; JLCPCB Part Class: Basic Part; Datasheet: https://atta.szlcsc.com/upload/public/pdf/source/20200306/C422600_1E6D84923E4A46A82E41ADD87F860B5C.pdf; Supplier: LCSC; Type: 厚膜电阻; Tolerance: ±1%; Power(Watts): 62.5mW; Temperature Coefficient: ±100ppm/℃; Overload Voltage (Max): 50V; Operating Temperature Range: -55℃~+155℃
R49 = 0402WGF1002TCE: 电阻类型:厚膜电阻;阻值:10kΩ;精度:±1%;功率:62.5mW;; LCSC Part Name: 10kΩ ±1% 62.5mW; Supplier Part: C25744; Manufacturer: UNI-ROYAL(厚声); Supplier Footprint: 0402; JLCPCB Part Class: 基础库; Datasheet: https://atta.szlcsc.com/upload/public/pdf/source/20200306/C422600_1E6D84923E4A46A82E41ADD87F860B5C.pdf; Supplier: LCSC; Type: 厚膜电阻; Tolerance: ±1%; Power(Watts): 62.5mW; Temperature Coefficient: ±100ppm/℃; Overload Voltage (Max): 50V; Operating Temperature Range: -55℃~+155℃
R327 = 0805W8F0000T5E: 电阻类型:厚膜电阻;阻值:0Ω;精度:±1%;功率:125mW;温度系数:±800ppm/℃;最大工作电压:150V;工作温度范围:-55℃~+155℃;; LCSC Part Name: 0Ω ±1% 125mW; Manufacturer: UNI-ROYAL(厚声); Supplier Footprint: 0805; JLCPCB Part Class: Basic Part; Datasheet: https://atta.szlcsc.com/upload/public/pdf/source/20200306/C422600_1E6D84923E4A46A82E41ADD87F860B5C.pdf; Supplier: LCSC; Type: 厚膜电阻; Tolerance: ±1%; Power(Watts): 125mW; Temperature Coefficient: ±800ppm/℃; Overload Voltage (Max): 150V; Operating Temperature Range: -55℃~+155℃
R328 R329 = CRCW040210K0FKED: 电阻类型:厚膜电阻;阻值:10kΩ;精度:±1%;功率:63mW;温度系数:±100ppm/K;最大工作电压:50V;工作温度范围:-55℃~+155℃;; LCSC Part Name: 10kΩ ±1% 63mW; Supplier Part: C71617; Manufacturer: VISHAY(威世); Supplier Footprint: 0402; JLCPCB Part Class: 扩展库; Datasheet: https://atta.szlcsc.com/upload/public/pdf/source/20180224/C71617_15194370300791364062.pdf; Supplier: LCSC; Type: 厚膜电阻; Tolerance: ±1%; Power(Watts): 63mW; Temperature Coefficient: ±100ppm/K; Overload Voltage (Max): 50V; Operating Temperature Range: -55℃~+155℃
U78 = SY6280AAC_C55136: 低能耗配电开关; Supplier Part: C55136; Manufacturer: silergy(矽力杰); Supplier Footprint: SOT-23-5; JLCPCB Part Class: Extended Part; Datasheet: https://atta.szlcsc.com/upload/public/pdf/source/20161108/1478586372822.pdf; Supplier: LCSC
USB2 = USB_TYPE-C-16P: Supplier Footprint: SMD
USB3 = USB-301WD-ARY: 连接器类型:Type-A;协议标准:USB 3.0;公母:母;安装方式:弯插;触点数量:9P;端口数量:1;额定电流 - 电源:1.8A;工作温度:-55℃~+85℃;; LCSC Part Name: Type-A 母 弯插; Supplier Part: C2895025; Manufacturer: XUNPU(讯普); Supplier Footprint: 插件; JLCPCB Part Class: 扩展库; Datasheet: https://item.szlcsc.com/datasheet/USB-301WD-ARY/3132962.html; Supplier: LCSC; Connector Type: Type-A; Protocol Standard: USB 3.0; Gender: 母; Mounting Type: 弯插; Number of Contacts: 9P; Number of Ports: 1; Current Rating-Power: 1.8A; Voltage Rating: 30V; Length: 16.5mm; Detection color: 蓝色; Operating Temperature: -55℃~+85℃

## Nets
GND: C4.1 C5.1 C20.2 C21.1 C22.1 C23.1 C24.1 C25.1 C26.1 C27.1 C28.1 C29.1 C30.1 C31.1 C32.1 C33.2 C34.1 C35.1 C36.1 C68.1 C69.1 C100.1 C110.1 C133.1 C139.1 C140.1 C141.1 C142.1 C143.1 C144.1 C145.1 C146.1 C147.1 C148.1 C149.1 C150.2 C151.2 C152.2 C153.2 C154.2 C155.2 C156.2 C157.2 C158.2 C159.2 C160.2 C161.2 C162.2 C163.2 C164.2 C165.2 C166.1 C167.1 C168.1 C169.2 C170.2 C171.2 C172.2 C173.2 C174.2 C175.2 C176.2 C177.2 C178.2 C179.2 C180.2 C181.2 C182.2 C183.2 C213.1 C238.1 C239.1 C240.1 C498.2 C510.1 C514.1 C515.2 CARD1.6(VSS) CARD1.10 CARD1.11 CARD1.12 CARD1.13 D2.3(GND) D2.8(GND) D3.3(GND) D3.8(GND) D29.3(GND) D29.8(GND) D30.3(GND) D30.8(GND) FPC3.5 FPC3.6 FPC3.7 FPC3.11 FPC3.14 FPC3.17 FPC3.20 FPC3.25 FPC3.26 H1.1 HDMI1.2(TMDSData2Shield) HDMI1.5(TMDSData1Shield) HDMI1.8(TMDSData0Shield) HDMI1.11(TMDSClockShield) HDMI1.17(DDC/CECGround) HDMI1.20(EH) PW.1(C) PWR.3 PWR.4 Q1.1(E1) Q1.4(E2) R48.1 R49.1 R220.1 R328.1 R329.1 R337.1 R382.1 R383.1 RST.3 RST.4 RST1.3 RST1.4 U1.2(GND) U1.4(GND) U4.AB24(TVSS) U4.N11(SYSPLL_AVSS) U4.V20(PMUPLL_AVSS) U6.A3(VSS_1) U6.A10(VSS_2) U6.AB3(VSS_55) U6.AB5(VSS_56) U6.AB8(VSS_57) U6.AB10(VSS_58) U6.C1(VSS_3) U6.C5(VSS_4) U6.C8(VSS_5) U6.C12(VSS_6) U6.D2(VSS_7) U6.D4(VSS_8) U6.D9(VSS_9) U6.D11(VSS_10) U6.E1(VSS_11) U6.E5(VSS_12) U6.E8(VSS_13) U6.E12(VSS_14) U6.G1(VSS_15) U6.G3(VSS_16) U6.G5(VSS_17) U6.G8(VSS_18) U6.G10(VSS_19) U6.G12(VSS_20) U6.J1(VSS_21) U6.J3(VSS_22) U6.J10(VSS_23) U6.J12(VSS_24) U6.K2(VSS_25) U6.K4(VSS_26) U6.K9(VSS_27) U6.K11(VSS_28) U6.N2(VSS_29) U6.N4(VSS_30) U6.N9(VSS_31) U6.N11(VSS_32) U6.P1(VSS_33) U6.P3(VSS_34) U6.P10(VSS_35) U6.P12(VSS_36) U6.T1(VSS_37) U6.T3(VSS_38) U6.T5(VSS_39) U6.T8(VSS_40) U6.T10(VSS_41) U6.T12(VSS_42) U6.V1(VSS_43) U6.V5(VSS_44) U6.V8(VSS_45) U6.V12(VSS_46) U6.W2(VSS_47) U6.W4(VSS_48) U6.W9(VSS_49) U6.W11(VSS_50) U6.Y1(VSS_51) U6.Y5(VSS_52) U6.Y8(VSS_53) U6.Y12(VSS_54) U8.2 U9.2 U10.2 U52.1 U53.1 U54.1 U55.1 U56.1 U57.1 U58.1 U58.4 U58.6 U58.10 U58.16 U58.17 U73.2 U74.2 U77.2 U78.2(GND) U80.1 U81.2 USB2.1(EP) USB2.2(EP) USB2.3(EP) USB2.4(EP) USB2.A1(GND) USB2.A12(GND) USB2.B1(GND) USB2.B12(GND) USB3.4(GND) USB3.7(GND_DRAIN) USB3.10(SHIELD) USB3.11(SHIELD) ; also on sheet 13 14 15 16 17 18 19 20 21 22 23 24 25 26 27
VCC0V6_DDR: C166.2 C167.2 C168.2 C169.1 C170.1 C171.1 C172.1 C173.1 C174.1 C175.1 C176.1 C177.1 C178.1 C179.1 C180.1 C181.1 C182.1 C183.1 R71.2 R72.2 U6.AA3(VDDQ_17) U6.AA5(VDDQ_18) U6.AA8(VDDQ_19) U6.AA10(VDDQ_20) U6.B3(VDDQ_1) U6.B5(VDDQ_2) U6.B8(VDDQ_3) U6.B10(VDDQ_4) U6.D1(VDDQ_5) U6.D5(VDDQ_6) U6.D8(VDDQ_7) U6.D12(VDDQ_8) U6.F3(VDDQ_9) U6.F10(VDDQ_10) U6.U3(VDDQ_11) U6.U10(VDDQ_12) U6.W1(VDDQ_13) U6.W5(VDDQ_14) U6.W8(VDDQ_15) U6.W12(VDDQ_16) ; also on sheet 18 26
VCC1V8_DDR: C139.2 C140.2 C141.2 C142.2 C143.2 C144.2 C145.2 R70.1 U6.F1(VDD1) U6.F12(VDD1_2) U6.G4(VDD1_3) U6.G9(VDD1_4) U6.T4(VDD1_5) U6.T9(VDD1_6) U6.U1(VDD1_7) U6.U12(VDD1_8) ; also on sheet 26
VCC3V3_PMU: C23.2 C30.2 R169.2 R170.2 R175.2 R176.2 U4.W19(PMUIO2) U4.Y20(PMUIO1) ; also on sheet 25 26
VCC3V3_SD: C514.2 C515.1 CARD1.4(VDD) R323.2 ; also on sheet 25
VCC3V3_SYS: C110.2 L23.1 R82.1 R83.1 R84.2 ; also on sheet 13 15 25 26 27
VCC5V0_USB30_OTG: Q5.3(D) Q6.2(E) R336.2 USB2.A4(VBUS) USB2.A9(VBUS) USB2.B4(VBUS) USB2.B9(VBUS)
VCC5V0_USB_HOST1: C239.2 C240.2 R327.2 U78.1(OUT) USB3.1(VBUS)
VCC5V_HDMI_TX: C100.2 D27.2(A) D28.1(K) HDMI1.18(+5VPower) Q3.1(G)
VCC-5V: C4.2 C5.2 C133.2 C213.2 C238.2 D28.2(A) F2.2 FPC3.1 FPC3.2 FPC3.3 FPC3.4 R327.1 U78.5(IN) ; also on sheet 15 17 25 26
VCC_3V3: Q2.1(G) Q4.1(G) R214.2 R216.2 R218.2 R323.1 ; also on sheet 14 15 20 22 24 25 27
VCC_DDR: C146.2 C147.2 C148.2 C149.2 C150.1 C151.1 C152.1 C153.1 C154.1 C155.1 C156.1 C157.1 C158.1 C159.1 C160.1 C161.1 C162.1 C163.1 C164.1 C165.1 U6.A4(VDD2_1) U6.A9(VDD2_2) U6.AB4(VDD2_23) U6.AB9(VDD2_24) U6.F5(VDD2_3) U6.F8(VDD2_4) U6.H1(VDD2_5) U6.H5(VDD2_6) U6.H8(VDD2_7) U6.H12(VDD2_8) U6.K1(VDD2_9) U6.K3(VDD2_10) U6.K10(VDD2_11) U6.K12(VDD2_12) U6.N1(VDD2_13) U6.N3(VDD2_14) U6.N10(VDD2_15) U6.N12(VDD2_16) U6.R1(VDD2_17) U6.R5(VDD2_18) U6.R8(VDD2_19) U6.R12(VDD2_20) U6.U5(VDD2_21) U6.U8(VDD2_22) ; also on sheet 18 25 26
VCCA1V8_PMU: C26.2 C27.2 R70.2 U4.Y21(PMUPLL_AVDD_1V8) ; also on sheet 25
VCCA_1V8: C31.2 C32.2 U4.N10(SYSPLL_AVDD_1V8) ; also on sheet 14 22 25
VCCIO_FLASH: C36.2 U4.H18(VCCIO2) ; also on sheet 24 26
VCCIO_SD: C35.2 U4.L22(VCCIO3) ; also on sheet 25
VDDA0V9_PMU: C24.2 C25.2 C33.1 C34.2 U4.V19(PMU_VDD_LOGIC_0V9) U4.V21(PMUPLL_AVDD_0V9) ; also on sheet 25
VDDA_0V9: C28.2 C29.2 U4.P11(SYSPLL_AVDD_0V9) ; also on sheet 22 25
4G_PWREN_H_GPIO0_D5: U4.AD25(GPIO0_D5_D)
BT_REG_ON_H_GPIO0_C1: U4.AF23(GPIO0_C1_D)
BT_WAKE_HOST_H_GPIO0_B7: U4.AH26(GPIO0_B7_D)
CAM0_CKN: U4.AH10(MIPI_CSI_RX_CLK0N) U58.8
CAM0_CKP: U4.AG10(MIPI_CSI_RX_CLK0P) U58.9
CAM0_DN0: U4.AH12(MIPI_CSI_RX_D0N) U58.2
CAM0_DN1: U4.AH11(MIPI_CSI_RX_D1N) U58.5
CAM0_DP0: U4.AG12(MIPI_CSI_RX_D0P) U58.3
CAM0_DP1: U4.AG11(MIPI_CSI_RX_D1P) U58.7
CAM0_GPIO: U58.11 ; also on sheet 20
CAM_3V3: C510.2 L23.2 U58.15
CAM_SCL: U58.13 ; also on sheet 20
CAM_SDA: U58.14 ; also on sheet 20
CHG_INT_L_GPIO0_C2: Q1.5(B2) U4.AG23(GPIO0_C2_D)
DDR_A0_A: U6.H2(CA0_A) ; also on sheet 18
DDR_A0_B: U6.R2(CA0_B) ; also on sheet 18
DDR_A1_A: U6.J2(CA1_A) ; also on sheet 18
DDR_A1_B: U6.P2(CA1_B) ; also on sheet 18
DDR_A2_A: U6.H9(CA2_A) ; also on sheet 18
DDR_A2_B: U6.R9(CA2_B) ; also on sheet 18
DDR_A3_A: U6.H10(CA3_A) ; also on sheet 18
DDR_A3_B: U6.R10(CA3_B) ; also on sheet 18
DDR_A4_A: U6.H11(CA4_A) ; also on sheet 18
DDR_A4_B: U6.R11(CA4_B) ; also on sheet 18
DDR_A5_A: U6.J11(CA5_A) ; also on sheet 18
DDR_A5_B: U6.P11(CA5_B) ; also on sheet 18
DDR_A_CKE0: U6.J4(CKE0_A) ; also on sheet 18
DDR_A_CKE1: U6.J5(CKE1_A) ; also on sheet 18
DDR_A_CLKN: U6.J9(CK_c_A) ; also on sheet 18
DDR_A_CLKP: U6.J8(CK_t_A) ; also on sheet 18
DDR_A_CS0: U6.H4(CS0_A) ; also on sheet 18
DDR_A_CS1: U6.H3(CS1_A) ; also on sheet 18
DDR_A_DQS0N: U6.E3(DQS0_c_A) ; also on sheet 18
DDR_A_DQS0P: U6.D3(DQS0_t_A) ; also on sheet 18
DDR_A_DQS1N: U6.E10(DQS1_c_A) ; also on sheet 18
DDR_A_DQS1P: U6.D10(DQS1_t_A) ; also on sheet 18
DDR_A_ODTCA: U6.G2(ODT_CA_A) ; also on sheet 18
DDR_B_CKE0: U6.P4(CKE0_B) ; also on sheet 18
DDR_B_CKE1: U6.P5(CKE1_B) ; also on sheet 18
DDR_B_CLKN: U6.P9(CK_c_B) ; also on sheet 18
DDR_B_CLKP: U6.P8(CK_t_B) ; also on sheet 18
DDR_B_CS0: U6.R4(CS0_B) ; also on sheet 18
DDR_B_CS1: U6.R3(CS1_B) ; also on sheet 18
DDR_B_DQS0N: U6.V3(DQS0_c_B) ; also on sheet 18
DDR_B_DQS0P: U6.W3(DQS0_t_B) ; also on sheet 18
DDR_B_DQS1N: U6.V10(DQS1_c_B) ; also on sheet 18
DDR_B_DQS1P: U6.W10(DQS1_t_B) ; also on sheet 18
DDR_B_ODTCA: U6.T2(ODT_CA_B) ; also on sheet 18
DDR_DM0_A: U6.C3(DMI0_A) ; also on sheet 18
DDR_DM0_B: U6.Y3(DMI0_B) ; also on sheet 18
DDR_DM1_A: U6.C10(DMI1_A) ; also on sheet 18
DDR_DM1_B: U6.Y10(DMI1_B) ; also on sheet 18
DDR_DQ0_A: U6.B2(DQ0_A) ; also on sheet 18
DDR_DQ0_B: U6.AA2(DQ0_B) ; also on sheet 18
DDR_DQ1_A: U6.C2(DQ1_A) ; also on sheet 18
DDR_DQ1_B: U6.Y2(DQ1_B) ; also on sheet 18
DDR_DQ2_A: U6.E2(DQ2_A) ; also on sheet 18
DDR_DQ2_B: U6.V2(DQ2_B) ; also on sheet 18
DDR_DQ3_A: U6.F2(DQ3_A) ; also on sheet 18
DDR_DQ3_B: U6.U2(DQ3_B) ; also on sheet 18
DDR_DQ4_A: U6.F4(DQ4_A) ; also on sheet 18
DDR_DQ4_B: U6.U4(DQ4_B) ; also on sheet 18
DDR_DQ5_A: U6.E4(DQ5_A) ; also on sheet 18
DDR_DQ5_B: U6.V4(DQ5_B) ; also on sheet 18
DDR_DQ6_A: U6.C4(DQ6_A) ; also on sheet 18
DDR_DQ6_B: U6.Y4(DQ6_B) ; also on sheet 18
DDR_DQ7_A: U6.B4(DQ7_A) ; also on sheet 18
DDR_DQ7_B: U6.AA4(DQ7_B) ; also on sheet 18
DDR_DQ8_A: U6.B11(DQ8_A) ; also on sheet 18
DDR_DQ8_B: U6.AA11(DQ8_B) ; also on sheet 18
DDR_DQ9_A: U6.C11(DQ9_A) ; also on sheet 18
DDR_DQ9_B: U6.Y11(DQ9_B) ; also on sheet 18
DDR_DQ10_A: U6.E11(DQ10_A) ; also on sheet 18
DDR_DQ10_B: U6.V11(DQ10_B) ; also on sheet 18
DDR_DQ11_A: U6.F11(DQ11_A) ; also on sheet 18
DDR_DQ11_B: U6.U11(DQ11_B) ; also on sheet 18
DDR_DQ12_A: U6.F9(DQ12_A) ; also on sheet 18
DDR_DQ12_B: U6.U9(DQ12_B) ; also on sheet 18
DDR_DQ13_A: U6.E9(DQ13_A) ; also on sheet 18
DDR_DQ13_B: U6.V9(DQ13_B) ; also on sheet 18
DDR_DQ14_A: U6.C9(DQ14_A) ; also on sheet 18
DDR_DQ14_B: U6.Y9(DQ14_B) ; also on sheet 18
DDR_DQ15_A: U6.B9(DQ15_A) ; also on sheet 18
DDR_DQ15_B: U6.AA9(DQ15_B) ; also on sheet 18
DDR_RESET: U6.T11(RESET_n) ; also on sheet 18
DVP_PWREN0_H_GPIO0_D3: U4.AE26(GPIO0_D3_D)
EMMC_CLKOUT/FLASH_DQS: R42.2 ; also on sheet 24
EMMC_CMD/FLASH_WRN: U4.B22(GPIO1_C4_U) ; also on sheet 24
EMMC_D0/FLASH_D0: R27.1 U4.A24(GPIO1_B4_U) ; also on sheet 24
EMMC_D1/FLASH_D1: U4.C21(GPIO1_B5_U) ; also on sheet 24
EMMC_D2/FLASH_D2: U4.B24(GPIO1_B6_U) ; also on sheet 24
EMMC_D3/FLASH_D3: U4.D21(GPIO1_B7_U) ; also on sheet 24
EMMC_D4/FLASH_D4: U4.A25(GPIO1_C0_U) ; also on sheet 24
EMMC_D5/FLASH_D5: U4.E21(GPIO1_C1_U) ; also on sheet 24
EMMC_D6/FLASH_D6: U4.E22(GPIO1_C2_U) ; also on sheet 24
EMMC_D7/FLASH_D7: U4.B25(GPIO1_C3_U) ; also on sheet 24
EMMC_DATA_STROBE/FLASH_CLE: U4.A26(GPIO1_C6_D) ; also on sheet 24
EMMC_RSTN/FSPI_D2/FLASH_WPN: U4.F20(GPIO1_C7_D) ; also on sheet 24
FLASH_VOL_SEL: U4.AG25(GPIO0_A7_U) ; also on sheet 26
GAMC1_MDIO_M0: FPC3.24 ; also on sheet 20
GMAC1_INT/PMEB_GPIO3_A7: FPC3.21 ; also on sheet 20
GMAC1_MDC_M0: FPC3.23 ; also on sheet 20
GMAC1_RSTN_GPIO3_B0: FPC3.22 ; also on sheet 20
HALL_INT_L_GPIO0_C6: U4.AD20(GPIO0_C6_D)
HDMI_TX0N_PORT: D29.2(I/O) D29.9(NC) HDMI1.9(TMDSData0-) ; also on sheet 19
HDMI_TX0P_PORT: D29.1(I/O) D29.10(NC) HDMI1.7(TMDSData0+) ; also on sheet 19
HDMI_TX1N_PORT: D2.5(I/O_4) D2.6(NC) HDMI1.6(TMDSData1-) ; also on sheet 19
HDMI_TX1P_PORT: D2.4(I/O_3) D2.7(NC) HDMI1.4(TMDSData1+) ; also on sheet 19
HDMI_TX2N_PORT: D2.2(I/O) D2.9(NC) HDMI1.3(TMDSData2-) ; also on sheet 19
HDMI_TX2P_PORT: D2.1(I/O) D2.10(NC) HDMI1.1(TMDSData2+) ; also on sheet 19
HDMI_TX_CEC_PORT: D3.1(I/O) D3.10(NC) HDMI1.13(CEC) Q3.3(D)
HDMI_TX_HPD_PORT: D3.5(I/O_4) D3.6(NC) HDMI1.19(HotPlugDetect) R219.2 R220.2
HDMI_TX_HPDIN: R219.1 ; also on sheet 19
HDMI_TX_SCL_PORT: D3.2(I/O) D3.9(NC) HDMI1.15(SCL) Q4.3(D) R215.1
HDMI_TX_SDA_PORT: D3.4(I/O_3) D3.7(NC) HDMI1.16(SDA) Q2.3(D) R217.1
HDMI_TXCLKN_PORT: D29.5(I/O_4) D29.6(NC) HDMI1.12(TMDSClock-) ; also on sheet 19
HDMI_TXCLKP_PORT: D29.4(I/O_3) D29.7(NC) HDMI1.10(TMDSClock+) ; also on sheet 19
HDMITX_CEC_M0: Q3.2(S) R218.1 ; also on sheet 14
HDMITX_SCL: Q4.2(S) R214.1 ; also on sheet 14
HDMITX_SDA: Q2.2(S) R216.1 ; also on sheet 14
HOST_WAKE_BT_H_GPIO0_B0: U4.AD23(GPIO0_B0_U)
I2C0_SCL_PMIC: R169.1 U4.AF24(GPIO0_B1_U) ; also on sheet 25 26
I2C0_SDA_PMIC: R170.1 U4.AB21(GPIO0_B2_U) ; also on sheet 25 26
I2C1_SCL_TP: R176.1 U4.AG24(GPIO0_B3_U) ; also on sheet 15
I2C1_SDA_TP: R175.1 U4.AB20(GPIO0_B4_U) ; also on sheet 15
LCD0_BL_PWM4: U4.AE23(GPIO0_C3_D) ; also on sheet 15
LCD0_PWREN_H_GPIO0_C7: U4.AH25(GPIO0_C7_D)
MIPI_AVDD_0V9: C68.2 U4.W14(MIPI_CSI_RX_AVDD_0V9) ; also on sheet 19 25
MIPI_AVDD_1V8: C69.2 U4.Y14(MIPI_CSI_RX_AVDD_1V8) ; also on sheet 19 25
MIPI_CSI_RX_CLK1N: U4.AH9(MIPI_CSI_RX_CLK1N)
MIPI_CSI_RX_CLK1P: U4.AG9(MIPI_CSI_RX_CLK1P)
MIPI_CSI_RX_D2N: U4.AD11(MIPI_CSI_RX_D2N)
MIPI_CSI_RX_D2P: U4.AE11(MIPI_CSI_RX_D2P)
MIPI_CSI_RX_D3N: U4.AE9(MIPI_CSI_RX_D3N)
MIPI_CSI_RX_D3P: U4.AD9(MIPI_CSI_RX_D3P)
PCIE20_CLKREQN_M1: FPC3.9 ; also on sheet 20
PCIE20_PERSTN_M1: FPC3.8 ; also on sheet 20
PCIE20_REFCLKN: C201.1 ; also on sheet 22
PCIE20_REFCLKP: C54.1 ; also on sheet 22
PCIE20_RXN: C209.1 ; also on sheet 22
PCIE20_RXP: C210.1 ; also on sheet 22
PCIE20_TXN: C202.1 ; also on sheet 22
PCIE20_TXP: C208.1 ; also on sheet 22
PCIE20_WAKEN_M1: FPC3.10 ; also on sheet 20
PCIE_PWREN_H_GPIO0_D4: U4.AB23(GPIO0_D4_D)
PMIC_INT_L: U4.AA22(GPIO0_A3_U) ; also on sheet 25
PMIC_PWRON: R81.1 ; also on sheet 25
PMIC_RESET_KEY: R80.1 ; also on sheet 25
PMIC_SLEEP_H: U4.AG28(GPIO0_A2_D) ; also on sheet 25 26
RESETn: C21.2 R2.2 U4.AH27(NPOR_U)
SDMMC0_CLK: R18.1 R369.1
SDMMC0_CMD: R368.1 U4.H27(GPIO2_A1_U)
SDMMC0_D0: R370.1 U4.J25(GPIO1_D5_U)
SDMMC0_D1: R371.1 U4.J24(GPIO1_D6_U)
SDMMC0_D2: R366.1 U4.H26(GPIO1_D7_U)
SDMMC0_D3: R367.1 U4.J23(GPIO2_A0_U)
SDMMC0_DET: R372.1 U4.Y22(GPIO0_A4_U)
SDMMC0_PWREN_L: U4.AF25(GPIO0_A5_D)
TP_INT: U4.AC22(GPIO0_B5_U) ; also on sheet 15
TP_RST: U4.AA20(GPIO0_B6_U) ; also on sheet 15
TSADC_SHUT_M0: R2.1 U4.AG26(GPIO0_A1_Z)
TYPEC_CC1: R382.2 USB2.A5(CC1)
TYPEC_CC2: R383.2 USB2.B5(CC2)
TYPEC_DM: R326.2 U73.1 USB2.A7(DN1) USB2.B7(DN2)
TYPEC_DP: R325.2 U74.1 USB2.A6(DP1) USB2.B6(DP2)
UART2_RX_M0_DEBUG: R378.2 U4.AC20(GPIO0_D0_U)
UART2_TX_M0_DEBUG: R377.2 U4.AH24(GPIO0_D1_U)
USB3_HOST1_DM: USB3.2(D-) ; also on sheet 22
USB3_HOST1_DP: USB3.3(D+) ; also on sheet 22
USB3_HOST1_SSRXN: R375.1 ; also on sheet 22
USB3_HOST1_SSRXN_M: D30.1(I/O) D30.10(NC) R375.2 USB3.5(StdA_SSRX-)
USB3_HOST1_SSRXP: R376.1 ; also on sheet 22
USB3_HOST1_SSRXP_M: D30.2(I/O) D30.9(NC) R376.2 USB3.6(StdA_SSRX+)
USB3_HOST1_SSTXN: C542.1 ; also on sheet 22
USB3_HOST1_SSTXN_M: C542.2 D30.4(I/O_3) D30.7(NC) USB3.8(StdA_SSTX-)
USB3_HOST1_SSTXP: C541.1 ; also on sheet 22
USB3_HOST1_SSTXP_M: C541.2 D30.5(I/O_4) D30.6(NC) USB3.9(StdA_SSTX+)
USB3_OTG0_DM: R326.1 ; also on sheet 22
USB3_OTG0_DP: R325.1 ; also on sheet 22
USB3_OTG0_VBUSDET: C498.1 R336.1 R337.2 ; also on sheet 22
USB5V0_EN_H_GPIO0_D6: U4.AC24(GPIO0_D6_D)
USB_HOST_PWREN_H_GPIO0_A6: R328.2 U4.AE24(GPIO0_A6_D) U78.4(EN)
USBCC_INT_L_GPIO0_C5: U4.AC21(GPIO0_C5_D)
WIFI_PWREN_GPIO0_A0: Q1.2(B1) U4.AG27(GPIO0_A0_D)
WIFI_REG_ON_H_GPIO0_C0: U4.AD22(GPIO0_C0_D)
WIFI_WAKE_HOST_H_GPIO0_C4: U4.AD21(GPIO0_C4_D)
$4N3266: R1.2 R3.2 U4.AF27(XOUT24M)
$4N3267: C22.2 R3.1 U1.1(OSC1) U4.AF28(XIN24M)
$4N3270: C20.1 R1.1 U1.3(OSC2)
$6N1222: R42.1 U4.A23(GPIO1_C5_D)
$6N1325: R18.2 U4.H28(GPIO2_A2_D)
$6N1326: R27.2 RST1.1 RST1.2 U10.1
$11N1464: R71.1 U6.A8(ZQ1_A)
$11N1465: R72.1 U6.A5(ZQ0_A)
$20N353: R80.2 RST.1 RST.2 U8.1
$20N493: PWR.1 PWR.2 R81.2 U9.1
$20N678: PW.2(A) R82.2
$20N810: PW1.2(A) R84.1
$20N926: PW1.1(C) Q1.3(C2)
$20N1002: PW2.2(A) R83.2
$20N1006: PW2.1(C) Q1.6(C1)
$20N2153: H1.3 R378.1 U77.1
$20N2155: H1.2 R377.1 U81.1
$21N2553: D27.1(K) R215.2 R217.2
$23N1845: R329.2 U78.3(ISET)
$23N3332: Q6.1(B) Q6.3(C) Q7.1(B) R49.2
$23N3333: Q5.1(G) Q7.3(C) R48.2
$23N3336: F2.1 Q5.2(S) Q7.2(E)
$24N768: CARD1.8(DAT1) R371.2 U56.2
$24N769: CARD1.CD R372.2 U80.2
$24N774: CARD1.7(DAT0) R370.2 U55.2
$24N776: CARD1.5(CLX) R369.2 U54.2
$24N777: CARD1.2(CD/DAT3) R367.2 U52.2
$24N778: CARD1.3(CMD) R368.2 U53.2
$24N785: CARD1.1(DAT2) R366.2 U57.2
$29N955: C54.2 FPC3.12
$29N957: C201.2 FPC3.13
$29N959: C202.2 FPC3.15
$29N961: C208.2 FPC3.16
$29N963: C209.2 FPC3.18
$29N965: C210.2 FPC3.19

Not connected (* = marked no-connect by the designer): HDMI1 14(Reserved(N.C.))*; U4 A22(GPIO1_D0_D)* A27(GPIO1_D4_U)* C23(GPIO1_D3_U)* C24(GPIO1_D1_U)* D23(GPIO1_D2_U)*; U6 A1(DNU_1) A2(DNU_2) A11(DNU_3) A12(DNU_4) AA1(DNU_7) AA12(DNU_8) AB1(DNU_9) AB2(DNU_10) AB11(DNU_11) AB12(DNU_12) B1(DNU_5) B12(DNU_6) G11(ZQ2_A_NC)* K5(CS2_A_NC)* K8(CKE2_A_NC)* N5(CS2_B_NC)* N8(CKE2_B_NC)*; U58 12*; USB2 A8(SBUS1) B8(SBUS2)

## Notes on the sheets
sheet 1
- Diff 100 Ohm ±10%
- Diff 100 Ohm ±10%
- Diff 100 Ohm ±10%
- Diff 100 Ohm ±10%
- Diff 100 Ohm ±10%
- Diff 100 Ohm ±10%
sheet 2
- HDMI2.0
  4K@60Hz
- LPDDR4X8GB
- WIFI/BT
  AIC8800D80
- EMMC5.1
- RK3568B2
- Quad-corte Cortex-A55
- GMAC
  RTL8211F
- PMIC
  PK8.9-5
- SDMMC2.0
- PCIE3.0x1
- AUDIO
- USB3.0
sheet 3
- I2C0 -> PMIC: RK809 & TCS435
  I2C1 -> Touch 3V3
  I2C2 -> Camera 1V8
  I2C3 -> Peripheral AUD
- PMUIO1: VCC3V3_PMU
  PMUIO2: VCC3V3_PMU
  VCCIO1: VCCIO_ACODEC 3V3
  VCCIO2: VCCIO_FLASH SEL
  VCCIO3: VCCIO_SD 2.0:3V3 3.0:1V8
  VCCIO4: VCCIO_WL 1V8
  VCCIO5: VCC_3V3
  VCCIO6: VCC_1V8
  VCCIO7: VCC_3V3
sheet 5
- 温度检测引脚
  结合传感器 温度过高复位芯片
  也可以通过内部热敏电阻
  与RK809复位相连接
  同时复位芯片和PMIC
  或者使用外部按钮复位
sheet 7
- 系统启动顺序
  Serial Nor Flash
  Serial Nand Flash
  Nand Flash
  eMMC
  SDMMC
  若找不到 会进入Maskrom
  也可以短接EMMC_D0 进入Maskrom
- 数据锁存
  从机发主机
sheet 9
- 侦测引脚
- 屏幕主动与主机通信线
  比如遥控器控制屏幕控制主机
sheet 10
- USB_POWER
- Current Limit：
  680mA
- 限流开关 超过680mA 关闭
- USB_POWER
